# EAGLE design carrier_board (EAGLE 9.4.2)
TITLE: Carrier Board

## Sheet 1 of 5: Slot 1
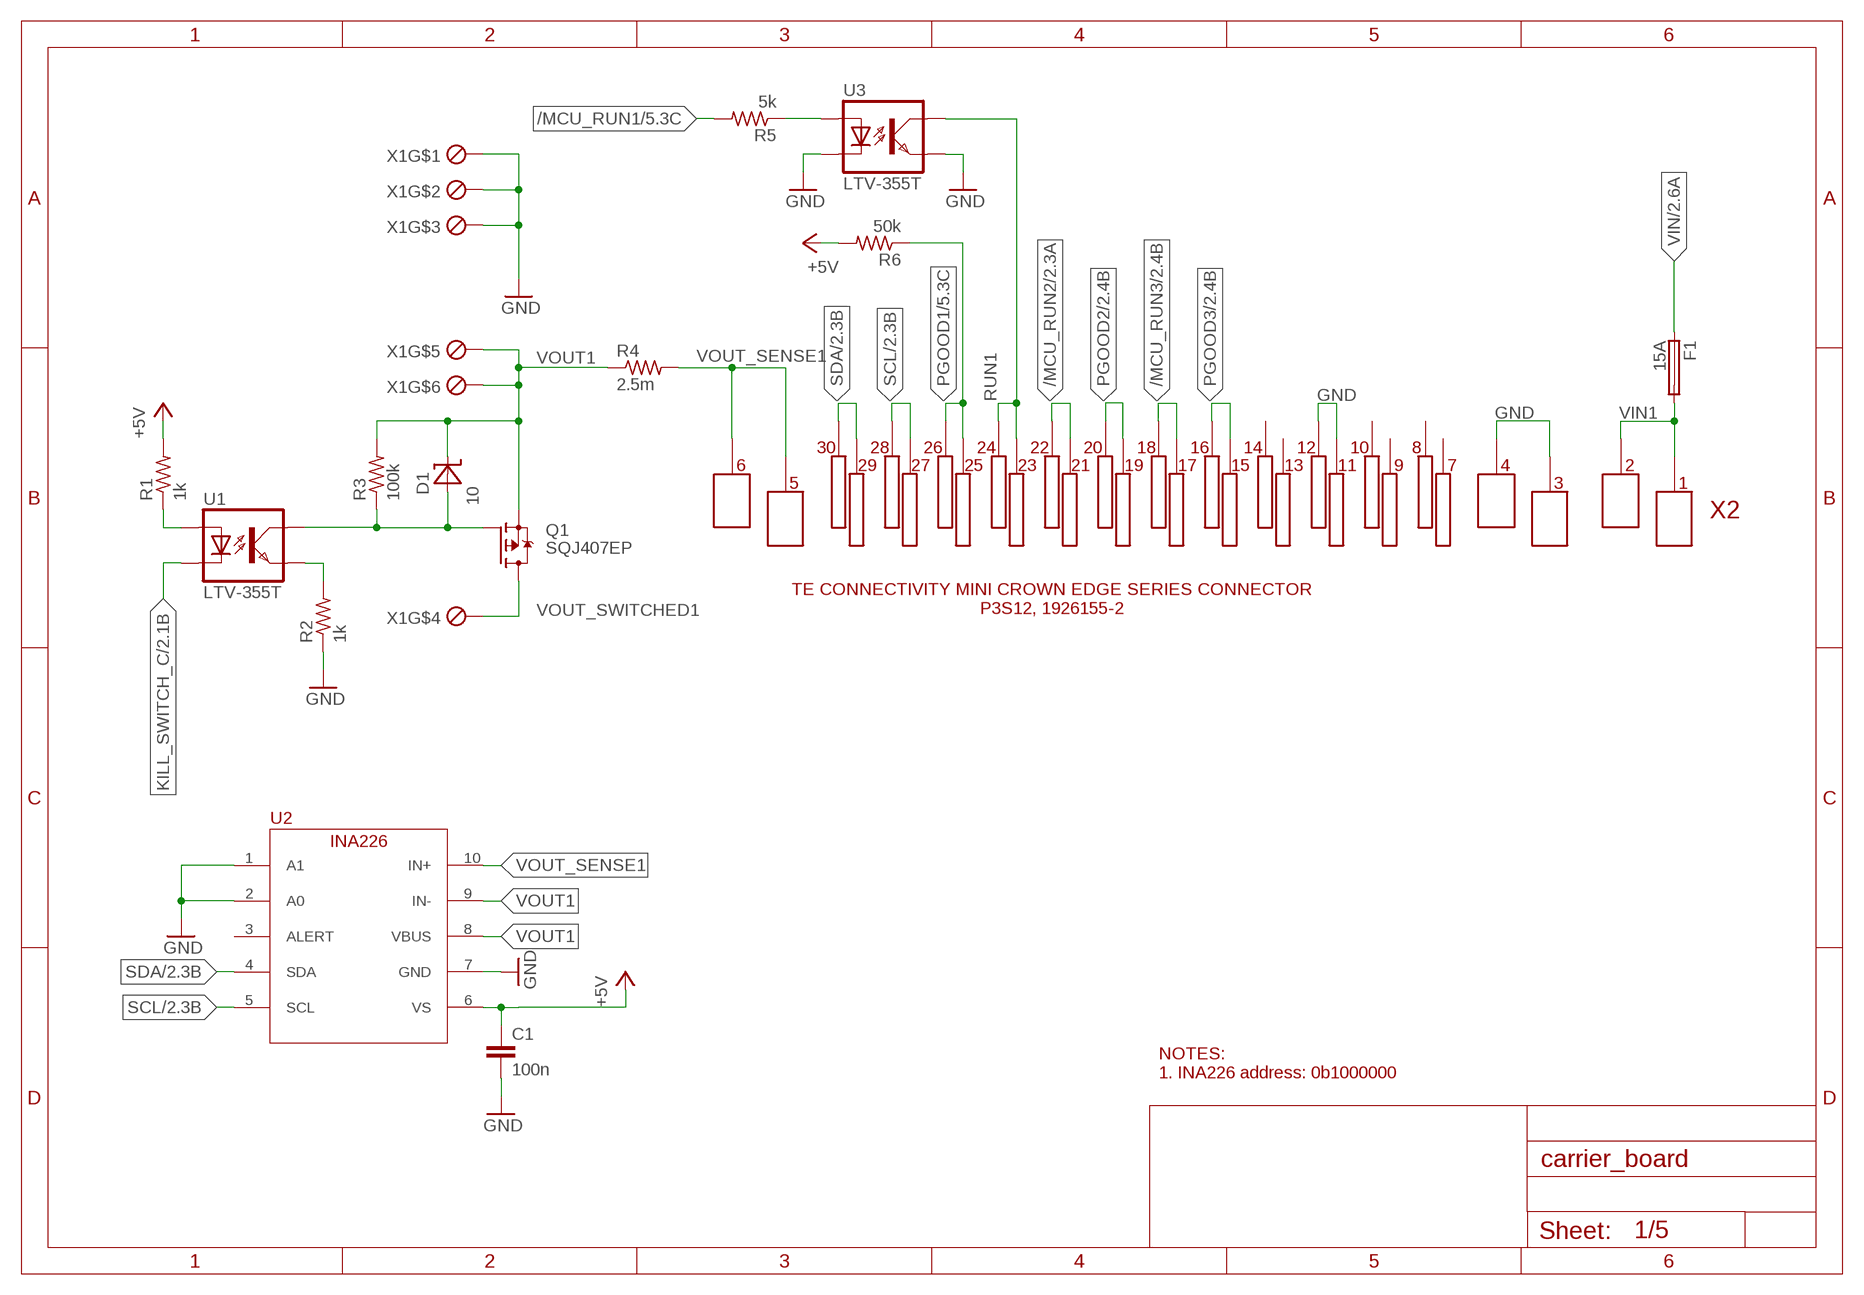
[diagram p0: schematic, sheet 1]

### Parts
C1  100n  C-EUC0603  [C0603]
D1  10  BZT52C10-TP  [SOD123]
F1  15A  3557-10  [3557-10]
Q1  SQJ407EP  [POWERPAK_SO8L_SINGLE]
R1  1k  R-US_R0603  [R0603]
R2  1k  R-US_R0603  [R0603]
R3  100k  R-US_R0603  [R0603]
R4  2.5m  R-US_R2512  [R2512]
R5  5k  R-US_R0603  [R0603]
R6  50k  R-US_R0603  [R0603]
U1  LTV-355T  [SMD4]
U2  INA226  [MSOP10]
U3  LTV-355T  [SMD4]
X1  284391-6  [284391-6]
X2  1926155-2_SOCK  [1926155-2_SOCK]

### Nets
+5V: C1.1 R1.2 R6.2 U2.6(VS) ; also sheet 2,3,4,5
/MCU_RUN1: R5.2 ; also sheet 5
/MCU_RUN2: X2.P$21 X2.P$22 ; also sheet 2,5
/MCU_RUN3: X2.P$17 X2.P$18 ; also sheet 2,3,5
GATE_VOUT1: D1.2(A) Q1.P$4(G) R3.1 U1.COLLECTOR(COL)
GND: C1.2 R2.1 U2.1(A1) U2.2(A0) U2.7(GND) U3.CATHODE(C) U3.EMITTER(EMIT) X1.P$1 X1.P$2 X1.P$3 X2.P$3_1 X2.P$3_2 X2.P$3_3 X2.P$4_1 X2.P$4_2 X2.P$4_3 X2.P$11 X2.P$12 ; also sheet 2,3,4,5
KILL_SWITCH_C: U1.CATHODE(C) ; also sheet 2,3,5
N$2: R2.2 U1.EMITTER(EMIT)
N$3: R5.1 U3.ANODE(A)
N$4: R1.1 U1.ANODE(A)
PGOOD1: R6.1 X2.P$25 X2.P$26 ; also sheet 5
PGOOD2: X2.P$19 X2.P$20 ; also sheet 2,5
PGOOD3: X2.P$15 X2.P$16 ; also sheet 2,3,5
RUN1: U3.COLLECTOR(COL) X2.P$23 X2.P$24
SCL: U2.5(SCL) X2.P$27 X2.P$28 ; also sheet 2,3,5
SDA: U2.4(SDA) X2.P$29 X2.P$30 ; also sheet 2,3,5
VIN: F1.P$1 F1.P$2 ; also sheet 2,3,4,5
VIN1: F1.P$3 F1.P$4 X2.P$1_1 X2.P$1_2 X2.P$1_3 X2.P$2_1 X2.P$2_2 X2.P$2_3
VOUT1: D1.1(C) Q1.P$1(S) Q1.P$2(S) Q1.P$3(S) R3.2 R4.1 U2.8(VBUS) U2.9(IN-) X1.P$5 X1.P$6
VOUT_SENSE1: R4.2 U2.10(IN+) X2.P$5_1 X2.P$5_2 X2.P$5_3 X2.P$6_1 X2.P$6_2 X2.P$6_3
VOUT_SWITCHED1: Q1.P$5(D) Q1.P$6(D) Q1.P$7(D) Q1.P$8(D) X1.P$4
Unconnected: U2.3(ALERT) X2.P$7 X2.P$8 X2.P$9 X2.P$10 X2.P$13 X2.P$14

### Notes on the sheet
- NOTES:
  1. INA226 address: 0b1000000

## Sheet 2 of 5: Slot 2
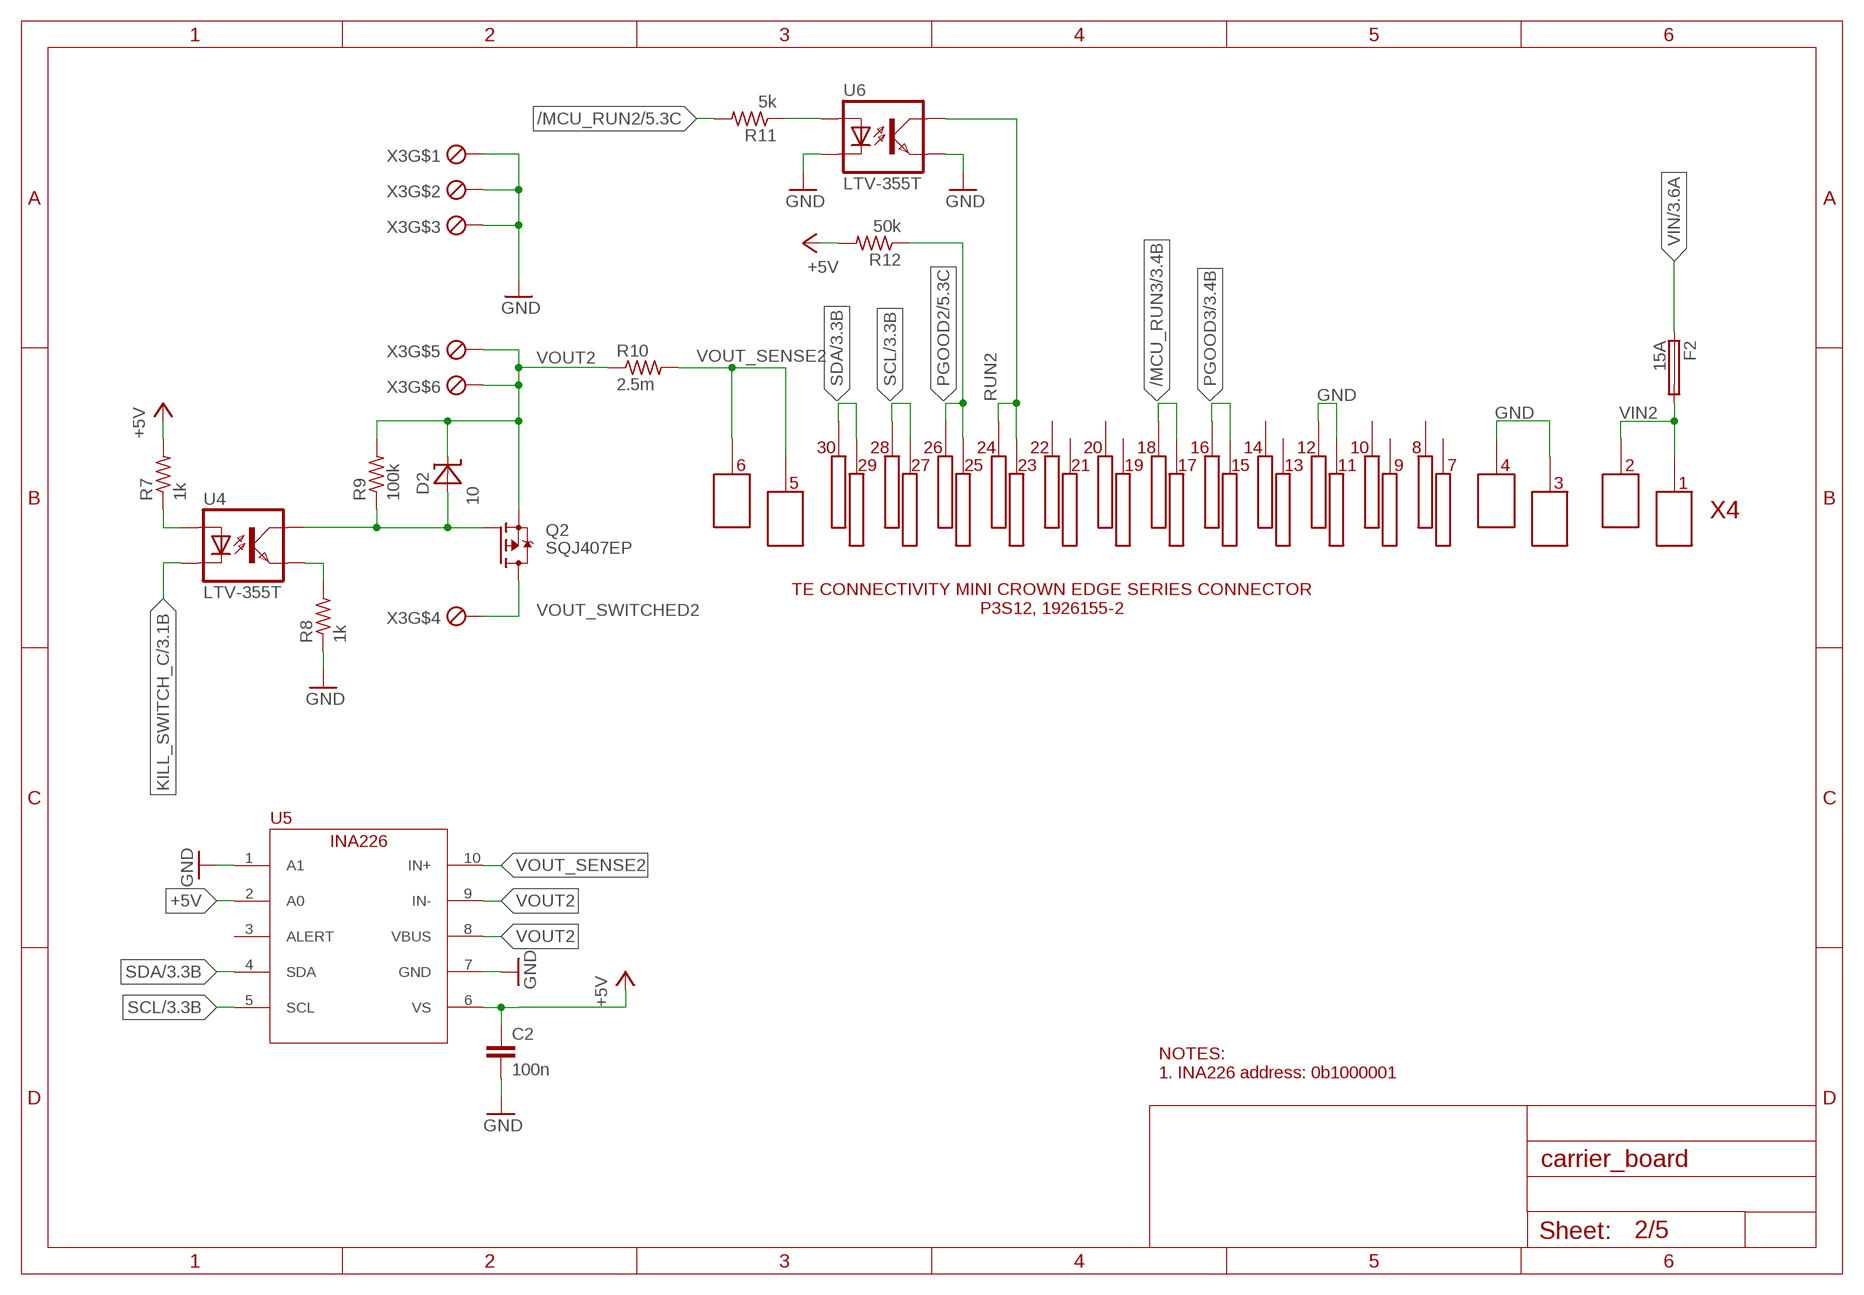
[diagram p1: schematic, sheet 2]

### Parts
C2  100n  C-EUC0603  [C0603]
D2  10  BZT52C10-TP  [SOD123]
F2  15A  3557-10  [3557-10]
Q2  SQJ407EP  [POWERPAK_SO8L_SINGLE]
R7  1k  R-US_R0603  [R0603]
R8  1k  R-US_R0603  [R0603]
R9  100k  R-US_R0603  [R0603]
R10  2.5m  R-US_R2512  [R2512]
R11  5k  R-US_R0603  [R0603]
R12  50k  R-US_R0603  [R0603]
U4  LTV-355T  [SMD4]
U5  INA226  [MSOP10]
U6  LTV-355T  [SMD4]
X3  284391-6  [284391-6]
X4  1926155-2_SOCK  [1926155-2_SOCK]

### Nets
+5V: C2.1 R7.2 R12.2 U5.2(A0) U5.6(VS) ; also sheet 1,3,4,5
/MCU_RUN2: R11.2 ; also sheet 1,5
/MCU_RUN3: X4.P$17 X4.P$18 ; also sheet 1,3,5
GATE_VOUT2: D2.2(A) Q2.P$4(G) R9.1 U4.COLLECTOR(COL)
GND: C2.2 R8.1 U5.1(A1) U5.7(GND) U6.CATHODE(C) U6.EMITTER(EMIT) X3.P$1 X3.P$2 X3.P$3 X4.P$3_1 X4.P$3_2 X4.P$3_3 X4.P$4_1 X4.P$4_2 X4.P$4_3 X4.P$11 X4.P$12 ; also sheet 1,3,4,5
KILL_SWITCH_C: U4.CATHODE(C) ; also sheet 1,3,5
N$7: R8.2 U4.EMITTER(EMIT)
N$8: R7.1 U4.ANODE(A)
N$9: R11.1 U6.ANODE(A)
PGOOD2: R12.1 X4.P$25 X4.P$26 ; also sheet 1,5
PGOOD3: X4.P$15 X4.P$16 ; also sheet 1,3,5
RUN2: U6.COLLECTOR(COL) X4.P$23 X4.P$24
SCL: U5.5(SCL) X4.P$27 X4.P$28 ; also sheet 1,3,5
SDA: U5.4(SDA) X4.P$29 X4.P$30 ; also sheet 1,3,5
VIN: F2.P$1 F2.P$2 ; also sheet 1,3,4,5
VIN2: F2.P$3 F2.P$4 X4.P$1_1 X4.P$1_2 X4.P$1_3 X4.P$2_1 X4.P$2_2 X4.P$2_3
VOUT2: D2.1(C) Q2.P$1(S) Q2.P$2(S) Q2.P$3(S) R9.2 R10.1 U5.8(VBUS) U5.9(IN-) X3.P$5 X3.P$6
VOUT_SENSE2: R10.2 U5.10(IN+) X4.P$5_1 X4.P$5_2 X4.P$5_3 X4.P$6_1 X4.P$6_2 X4.P$6_3
VOUT_SWITCHED2: Q2.P$5(D) Q2.P$6(D) Q2.P$7(D) Q2.P$8(D) X3.P$4
Unconnected: U5.3(ALERT) X4.P$7 X4.P$8 X4.P$9 X4.P$10 X4.P$13 X4.P$14 X4.P$19 X4.P$20 X4.P$21 X4.P$22

### Notes on the sheet
- NOTES:
  1. INA226 address: 0b1000001

## Sheet 3 of 5: Slot 3
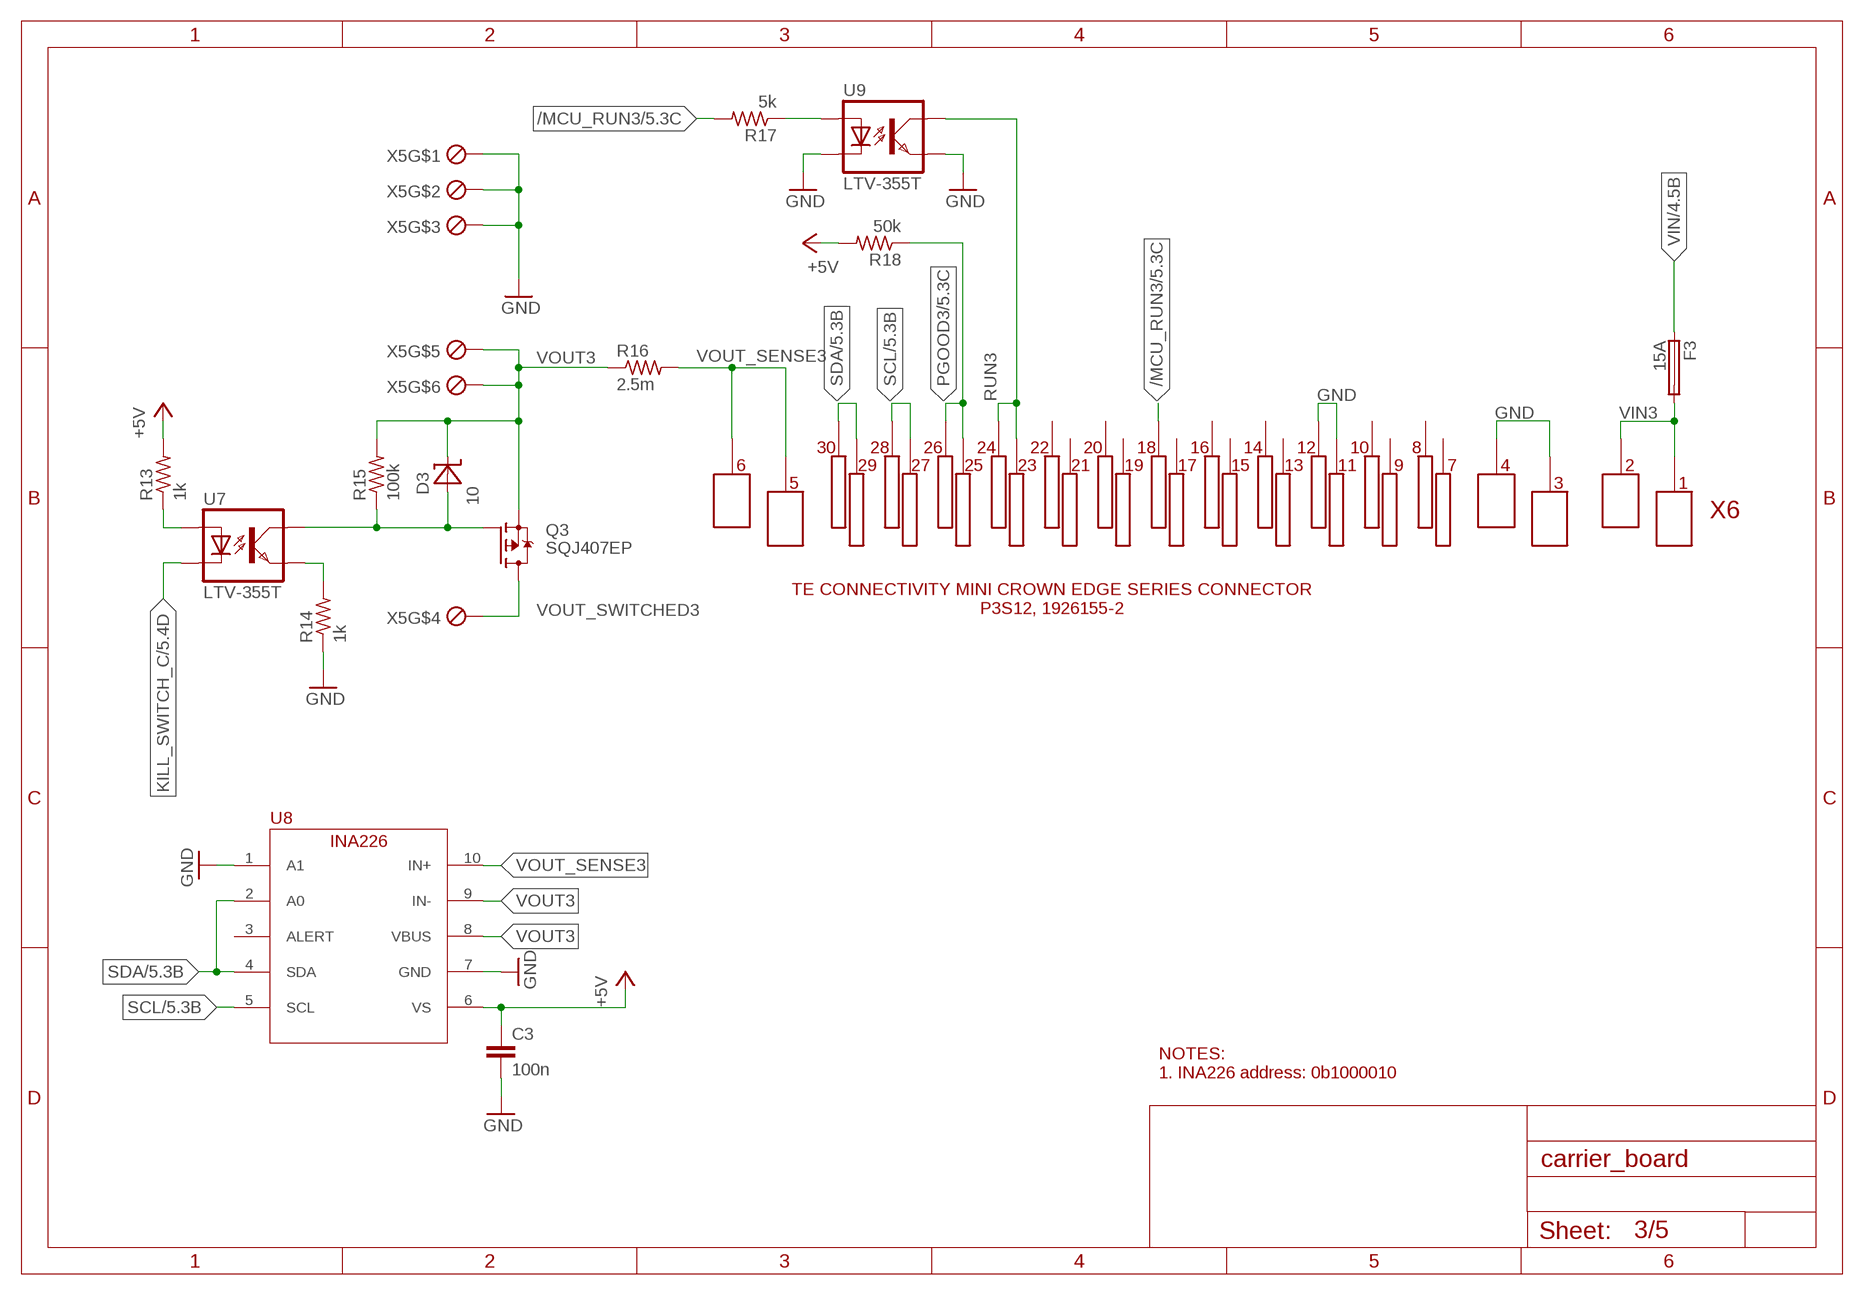
[diagram p2: schematic, sheet 3]

### Parts
C3  100n  C-EUC0603  [C0603]
D3  10  BZT52C10-TP  [SOD123]
F3  15A  3557-10  [3557-10]
Q3  SQJ407EP  [POWERPAK_SO8L_SINGLE]
R13  1k  R-US_R0603  [R0603]
R14  1k  R-US_R0603  [R0603]
R15  100k  R-US_R0603  [R0603]
R16  2.5m  R-US_R2512  [R2512]
R17  5k  R-US_R0603  [R0603]
R18  50k  R-US_R0603  [R0603]
U7  LTV-355T  [SMD4]
U8  INA226  [MSOP10]
U9  LTV-355T  [SMD4]
X5  284391-6  [284391-6]
X6  1926155-2_SOCK  [1926155-2_SOCK]

### Nets
+5V: C3.1 R13.2 R18.2 U8.6(VS) ; also sheet 1,2,4,5
/MCU_RUN3: R17.2 X6.P$18 ; also sheet 1,2,5
GATE_VOUT3: D3.2(A) Q3.P$4(G) R15.1 U7.COLLECTOR(COL)
GND: C3.2 R14.1 U8.1(A1) U8.7(GND) U9.CATHODE(C) U9.EMITTER(EMIT) X5.P$1 X5.P$2 X5.P$3 X6.P$3_1 X6.P$3_2 X6.P$3_3 X6.P$4_1 X6.P$4_2 X6.P$4_3 X6.P$11 X6.P$12 ; also sheet 1,2,4,5
KILL_SWITCH_C: U7.CATHODE(C) ; also sheet 1,2,5
N$13: R14.2 U7.EMITTER(EMIT)
N$14: R13.1 U7.ANODE(A)
N$15: R17.1 U9.ANODE(A)
PGOOD3: R18.1 X6.P$25 X6.P$26 ; also sheet 1,2,5
RUN3: U9.COLLECTOR(COL) X6.P$23 X6.P$24
SCL: U8.5(SCL) X6.P$27 X6.P$28 ; also sheet 1,2,5
SDA: U8.2(A0) U8.4(SDA) X6.P$29 X6.P$30 ; also sheet 1,2,5
VIN: F3.P$1 F3.P$2 ; also sheet 1,2,4,5
VIN3: F3.P$3 F3.P$4 X6.P$1_1 X6.P$1_2 X6.P$1_3 X6.P$2_1 X6.P$2_2 X6.P$2_3
VOUT3: D3.1(C) Q3.P$1(S) Q3.P$2(S) Q3.P$3(S) R15.2 R16.1 U8.8(VBUS) U8.9(IN-) X5.P$5 X5.P$6
VOUT_SENSE3: R16.2 U8.10(IN+) X6.P$5_1 X6.P$5_2 X6.P$5_3 X6.P$6_1 X6.P$6_2 X6.P$6_3
VOUT_SWITCHED3: Q3.P$5(D) Q3.P$6(D) Q3.P$7(D) Q3.P$8(D) X5.P$4
Unconnected: U8.3(ALERT) X6.P$7 X6.P$8 X6.P$9 X6.P$10 X6.P$13 X6.P$14 X6.P$15 X6.P$16 X6.P$17 X6.P$19 X6.P$20 X6.P$21 X6.P$22

### Notes on the sheet
- NOTES:
  1. INA226 address: 0b1000010

## Sheet 4 of 5: Hotswap System
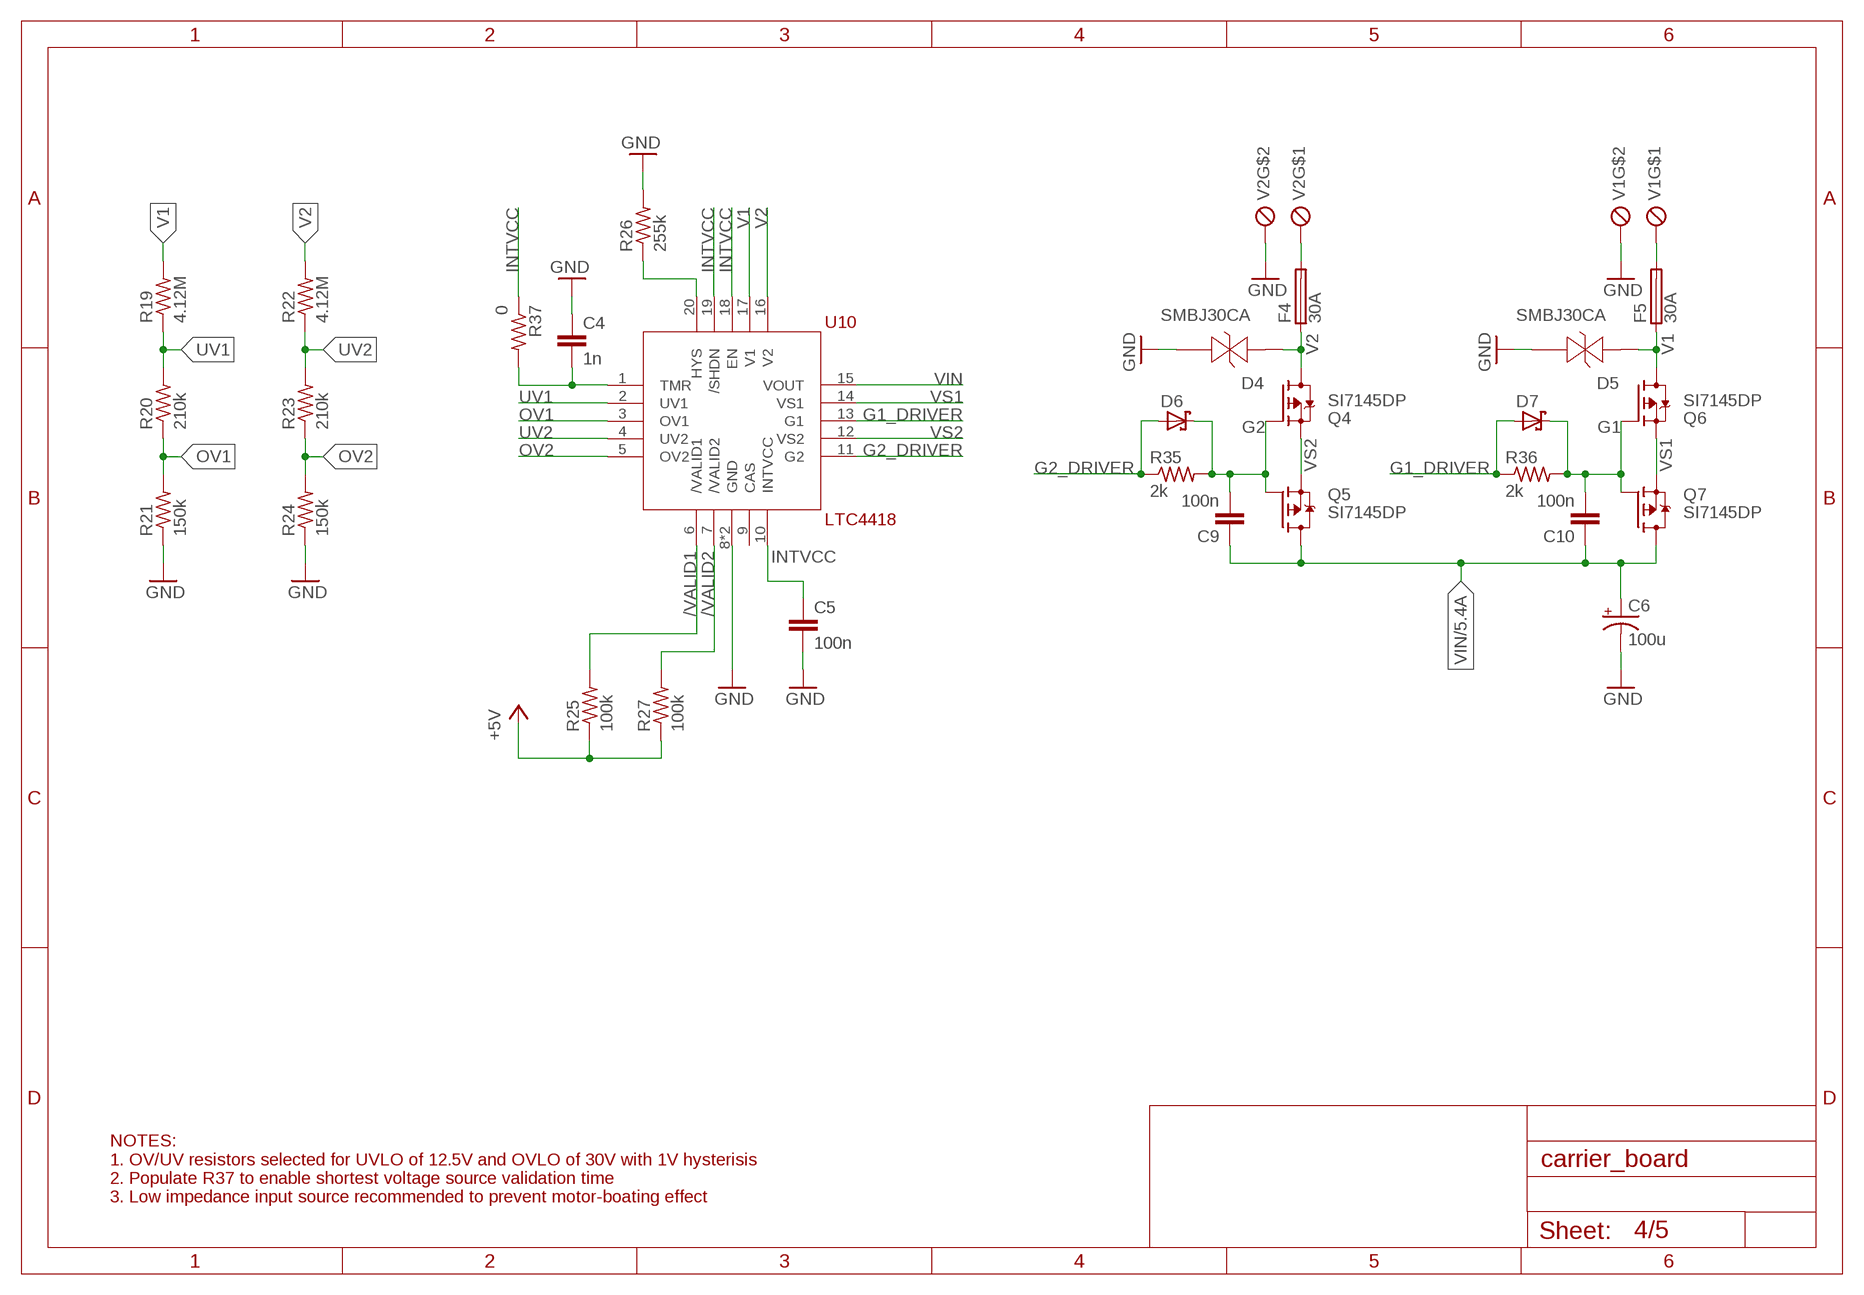
[diagram p3: schematic, sheet 4]

### Parts
C4  1n  C-EUC0402  [C0402]
C5  100n  C-EUC0402  [C0402]
C6  100u  CPOL-USE5-10.5  [E5-10,5]
C9  100n  C-EUC0603  [C0603]
C10  100n  C-EUC0603  [C0603]
D4  SMBJ30CA  [DO214AA]
D5  SMBJ30CA  [DO214AA]
D6  SD0603S040S0R2  [CHIPLED_0603]
D7  SD0603S040S0R2  [CHIPLED_0603]
F4  30A  3557-10  [3557-10]
F5  30A  3557-10  [3557-10]
Q4  SI7145DP  SI7145  [SO-8-POWERPAK]
Q5  SI7145DP  SI7145  [SO-8-POWERPAK]
Q6  SI7145DP  SI7145  [SO-8-POWERPAK]
Q7  SI7145DP  SI7145  [SO-8-POWERPAK]
R19  4.12M  R-US_R0402  [R0402]
R20  210k  R-US_R0402  [R0402]
R21  150k  R-US_R0402  [R0402]
R22  4.12M  R-US_R0402  [R0402]
R23  210k  R-US_R0402  [R0402]
R24  150k  R-US_R0402  [R0402]
R25  100k  R-US_R0603  [R0603]
R26  255k  R-US_R0402  [R0402]
R27  100k  R-US_R0603  [R0603]
R35  2k  R-US_R0603  [R0603]
R36  2k  R-US_R0603  [R0603]
R37  0  R-US_R0402  [R0402]
U10  LTC4418  [QFN20]
V1  MKDSD_1730502  [MKDSD_1730502]
V2  MKDSD_1730502  [MKDSD_1730502]

### Nets
+5V: R25.1 R27.1 ; also sheet 1,2,3,5
/VALID1: R25.2 U10.6(/VALID1) ; also sheet 5
/VALID2: R27.2 U10.7(/VALID2) ; also sheet 5
G1: C10.2 D7.C Q6.4(G) Q7.4(G) R36.2
G1_DRIVER: D7.A R36.1 U10.13(G1)
G2: C9.2 D6.C Q4.4(G) Q5.4(G) R35.2
G2_DRIVER: D6.A R35.1 U10.11(G2)
GND: C4.1 C5.2 C6.- D4.A D5.A R21.1 R24.1 R26.2 U10.8(GND) U10.EXP(GND) V1.P$2 V1.P$4 V2.P$2 V2.P$4 ; also sheet 1,2,3,5
HYS: R26.1 U10.20(HYS)
INTVCC: C5.1 R37.1 U10.10(INTVCC) U10.18(EN) U10.19(/SHDN)
OV1: R20.1 R21.2 U10.3(OV1)
OV2: R23.1 R24.2 U10.5(OV2)
TMR: C4.2 R37.2 U10.1(TMR)
UV1: R19.1 R20.2 U10.2(UV1)
UV2: R22.1 R23.2 U10.4(UV2)
V1: D5.C F5.P$1 F5.P$2 Q6.5(D) Q6.6(D) Q6.7(D) Q6.8(D) Q6.P$1(D) R19.2 U10.17(V1)
V2: D4.C F4.P$1 F4.P$2 Q4.5(D) Q4.6(D) Q4.7(D) Q4.8(D) Q4.P$1(D) R22.2 U10.16(V2)
VBAT1: F5.P$3 F5.P$4 V1.P$1 V1.P$3
VBAT2: F4.P$3 F4.P$4 V2.P$1 V2.P$3
VIN: C6.+ C9.1 C10.1 Q5.5(D) Q5.6(D) Q5.7(D) Q5.8(D) Q5.P$1(D) Q7.5(D) Q7.6(D) Q7.7(D) Q7.8(D) Q7.P$1(D) U10.15(VOUT) ; also sheet 1,2,3,5
VS1: Q6.1(S) Q6.2(S) Q6.3(S) Q7.1(S) Q7.2(S) Q7.3(S) U10.14(VS1)
VS2: Q4.1(S) Q4.2(S) Q4.3(S) Q5.1(S) Q5.2(S) Q5.3(S) U10.12(VS2)
Unconnected: U10.9(CAS)

### Notes on the sheet
- NOTES:
  1. OV/UV resistors selected for UVLO of 12.5V and OVLO of 30V with 1V hysterisis
  2. Populate R37 to enable shortest voltage source validation time
  3. Low impedance input source recommended to prevent motor-boating effect

## Sheet 5 of 5: Support Systems
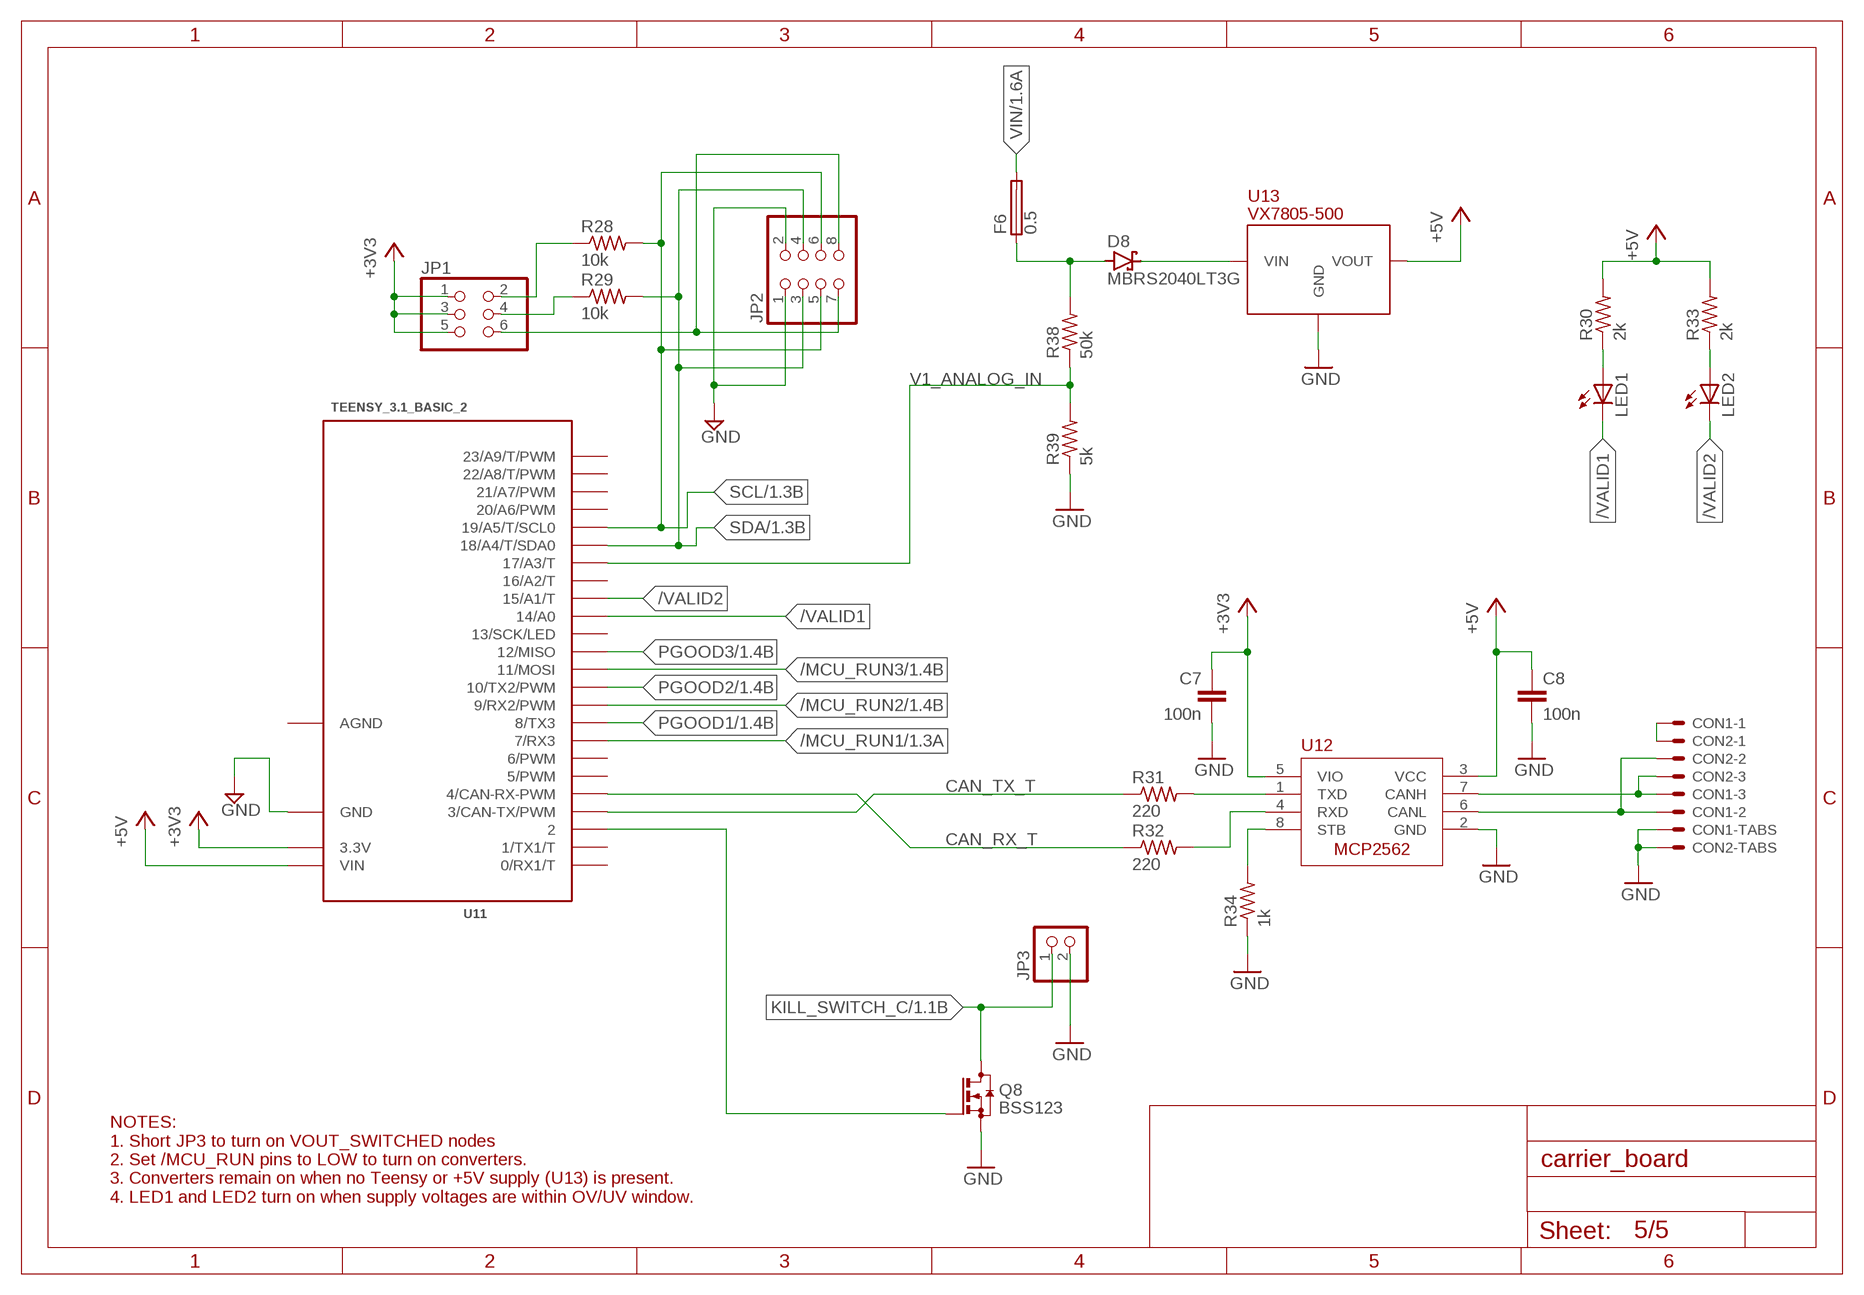
[diagram p4: schematic, sheet 5]

### Parts
C7  100n  C-EUC0805  [C0805]
C8  100n  C-EUC0805  [C0805]
CON1  SM03B-GHS-TB  [SM03B-GHS-TB]
CON2  SM03B-GHS-TB  [SM03B-GHS-TB]
D8  MBRS2040LT3G  MBRS130LT3  [SMB]
F6  0.5  501_FUSE  [R1206]
JP1  PINHD-2X3  [2X03]
JP2  PINHD-2X4  [2X04]
JP3  PINHD-1X02_2.54-SMD-90°  [1X02SMD/90]
LED1  LEDCHIPLED_0603  [CHIPLED_0603]
LED2  LEDCHIPLED_0603  [CHIPLED_0603]
Q8  BSS123  [SOT23]
R28  10k  R-US_R0805  [R0805]
R29  10k  R-US_R0805  [R0805]
R30  2k  R-US_R0603  [R0603]
R31  220  R-US_R0805  [R0805]
R32  220  R-US_R0805  [R0805]
R33  2k  R-US_R0603  [R0603]
R34  1k  R-US_R0805  [R0805]
R38  50k  R-US_R0603  [R0603]
R39  5k  R-US_R0603  [R0603]
U11  TEENSY_3.1_BASIC_2  [TEENSY_3.1_BASIC_2]
U12  MCP2562  [SO-8]
U13  VX7805-500  0.1"_LINEAR_REGULATOR_REPLACEMENT  [0.1"_LINEAR_REGULATOR_REPLACEMENT]

### Nets
+3V3: C7.1 JP1.1 JP1.3 JP1.5 U11.3.3V U12.5(VIO)
+5V: C8.1 R30.2 R33.2 U11.VIN U12.3(VCC) U13.3(VOUT) ; also sheet 1,2,3,4
/MCU_RUN1: U11.7(7/RX3) ; also sheet 1
/MCU_RUN2: U11.9(9/RX2/PWM) ; also sheet 1,2
/MCU_RUN3: U11.11(11/MOSI) ; also sheet 1,2,3
/VALID1: LED1.C U11.14/A0 ; also sheet 4
/VALID2: LED2.C U11.15/A1(15/A1/T) ; also sheet 4
CAN_RX: R32.2 U12.4(RXD)
CAN_RX_T: R32.1 U11.4(4/CAN-RX-PWM)
CAN_TX: R31.2 U12.1(TXD)
CAN_TX_T: R31.1 U11.3(3/CAN-TX/PWM)
CANH: CON1.P$3 CON2.P$3 U12.7(CANH)
CANL: CON1.P$2 CON2.P$2 U12.6(CANL)
CANSH: CON1.P$1 CON2.P$1
GND: C7.2 C8.2 CON1.P$4 CON1.P$5 CON2.P$4 CON2.P$5 JP2.1 JP2.2 JP3.2 Q8.2(S) R34.1 R39.1 U11.GND U12.2(GND) U13.2(GND) ; also sheet 1,2,3,4
I2C_3V3: JP1.6 JP2.7 JP2.8
KILL_SWITCH_C: JP3.1 Q8.3(D) ; also sheet 1,2,3
N$1: D8.A F6.1 R38.2
N$5: LED1.A R30.1
N$6: LED2.A R33.1
N$10: Q8.1(G) U11.2
N$11: D8.C U13.1(VIN)
PGOOD1: U11.8(8/TX3) ; also sheet 1
PGOOD2: U11.10(10/TX2/PWM) ; also sheet 1,2
PGOOD3: U11.12(12/MISO) ; also sheet 1,2,3
SCL: JP2.5 JP2.6 R28.2 U11.19/A5(19/A5/T/SCL0) ; also sheet 1,2,3
SCL_3V3: JP1.2 R28.1
SDA: JP2.3 JP2.4 R29.2 U11.18/A4(18/A4/T/SDA0) ; also sheet 1,2,3
SDA_3V3: JP1.4 R29.1
STB: R34.2 U12.8(STB)
V1_ANALOG_IN: R38.1 R39.2 U11.17/A3(17/A3/T)
VIN: F6.2 ; also sheet 1,2,3,4
Unconnected: U11.0(0/RX1/T) U11.1(1/TX1/T) U11.5(5/PWM) U11.6(6/PWM) U11.13(13/SCK/LED) U11.16/A2(16/A2/T) U11.20/A6(20/A6/PWM) U11.21/A7(21/A7/PWM) U11.22/A8(22/A8/T/PWM) U11.23/A9(23/A9/T/PWM)

### Notes on the sheet
- NOTES:
  1. Short JP3 to turn on VOUT_SWITCHED nodes
  2. Set /MCU_RUN pins to LOW to turn on converters.
  3. Converters remain on when no Teensy or +5V supply (U13) is present.
  4. LED1 and LED2 turn on when supply voltages are within OV/UV window.

## Power pins joined to a net without a drawn wire
AGND: U11.AGND

## Library data of the parts
C1-C5 C7-C10 = rcl:C-EU: CAPACITOR, European symbol; SPICEPREFIX: C
C6 = rcl:CPOL-US: POLARIZED CAPACITOR, American symbol; SPICEPREFIX: C
CON1 CON2 = ARVP:SM03B-GHS-TB
D1-D3 = LTM4607:BZT52C10-TP
D4 D5 = LTM4607:SMBJ30CA
D6 D7 = LTM4607:SD0603S040S0R2
D8 = diode:MBRS130LT3: Schottky Power Rectifier Source: http://www.onsemi.com/pub/Collateral/MBRS130LT3-D.PDF
F1-F5 = LTM4607:3557-10
F6 = LTM4607:501_FUSE
JP1 = pinhead:PINHD-2X3: PIN HEADER
JP2 = pinhead:PINHD-2X4: PIN HEADER
JP3 = pinhead-2:PINHD-1X02: PIN HEADER
LED1 LED2 = led:LED: LED OSRAM: - CHIPLED LG R971, LG N971, LY N971, LG Q971, LY Q971, LO R971, LY R971 LH N974, LH R974 LS Q976, LO Q976, LY Q976 LO Q996 - Hyper CHIPLED LW Q18S LB Q993, LB Q99A, LB R99A - SideLED LS A670, LO A670, LY A670, LG A670, LP A670 LB A673, LV A673, LT A673, LW A673 LH A674 LY A675 LS A676, LA A676, LO A676, LY A676, LW A676 LS A679, LY A679, LG A679 - Hyper Micro SIDELED® LS Y876, LA Y876, LO Y876, LY Y876 LT Y87S - SmartLED LW L88C, LW L88S LB L89C, LB L89S, LG L890 LS L89K, LO L89K, LY L89K LS L896, LA L896, LO L896, LY L896 - TOPLED LS T670, LO T670, LY T670, LG T670, LP T670 LSG T670, LSP T670, LSY T670, LOP T670, LYG T670 LG T671, LOG T671, LSG T671 LB T673, LV T673, LT T673, LW T673 LH T674 LS T676, LA T676, LO T676, LY T676, LB T676, LH T676, LSB T676, LW T676 LB T67C, LV T67C, LT T67C, LS T67K, LO T67K, LY T67K, LW E67C LS E67B, LA E67B, LO E67B, LY E67B, LB E67C, LV E67C, LT E67C LW T67C LS T679, LY T679, LG T679 LS T770, LO T770, LY T770, LG T770, LP T770 LB T773, LV T773, LT T773, LW T773 LH T774 LS E675, LA E675, LY E675, LS T675 LS T776, LA T776, LO T776, LY T776, LB T776 LHGB T686 LT T68C, LB T68C - Hyper Mini TOPLED® LB M676 - Mini TOPLED Santana® LG M470 LS M47K, LO M47K, LY M47K Source: http://www.osram.convergy.de LUXEON: - LUMILED® LXK2-PW12-R00, LXK2-PW12-S00, LXK2-PW14-U00, LXK2-PW14-V00 LXK2-PM12-R00, LXK2-PM12-S00, LXK2-PM14-U00 LXK2-PE12-Q00, LXK2-PE12-R00, LXK2-PE12-S00, LXK2-PE14-T00, LXK2-PE14-U00 LXK2-PB12-K00, LXK2-PB12-L00, LXK2-PB12-M00, LXK2-PB14-N00, LXK2-PB14-P00, LXK2-PB14-Q00 LXK2-PR12-L00, LXK2-PR12-M00, LXK2-PR14-Q00, LXK2-PR14-R00 LXK2-PD12-Q00, LXK2-PD12-R00, LXK2-PD12-S00 LXK2-PH12-R00, LXK2-PH12-S00 LXK2-PL12-P00, LXK2-PL12-Q00, LXK2-PL12-R00 Source: www.luxeon.com KINGBRIGHT: KA-3528ASYC Source: www.kingbright.com
Q1-Q3 = LTM4607:SQJ407EP
Q4-Q7 = LTM4607:SI7145
Q8 = transistor-small-signal:BSS123: N-CHANNEL MOS FET
R1-R39 = rcl:R-US_: RESISTOR, American symbol; SPICEPREFIX: R
U1 U3 U4 U6 U7 U9 = dropper_torpedo_v3:LTV-355T
U2 U5 U8 = LTM4607:INA226
U10 = LTM4607:LTC4418
U11 = Teensy_3_Series_Board_v1.0:TEENSY_3.1_BASIC_2: Footprint for Teensy 3.1 board using all pin connections on the outer perimeter
U12 = ARVP:MCP2562
U13 = LTM4607:0.1"_LINEAR_REGULATOR_REPLACEMENT
V1 V2 = LTM4607:MKDSD_1730502
X1 X3 X5 = LTM4607:284391-6
X2 X4 X6 = LTM4607:1926155-2_SOCK

## Net classes
1 net1: clearance 0.203 mm to class 0

## Board
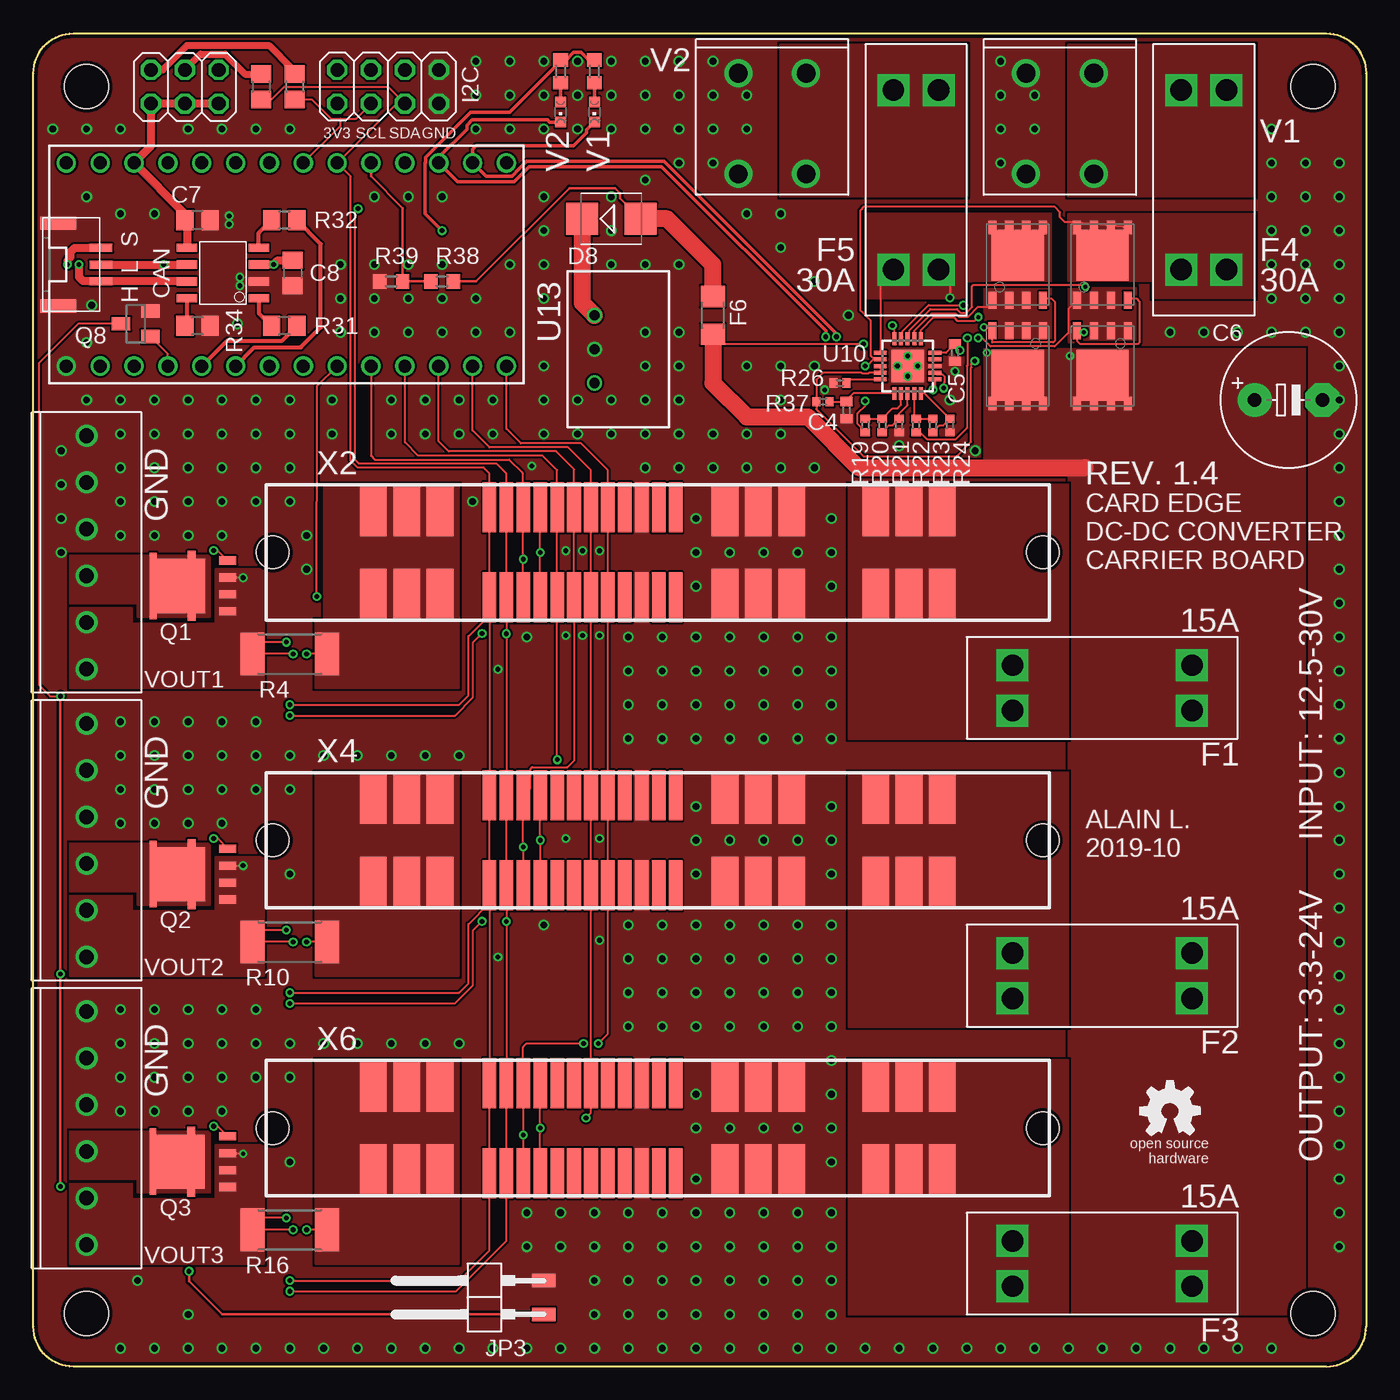
[diagram p5: board, top side]
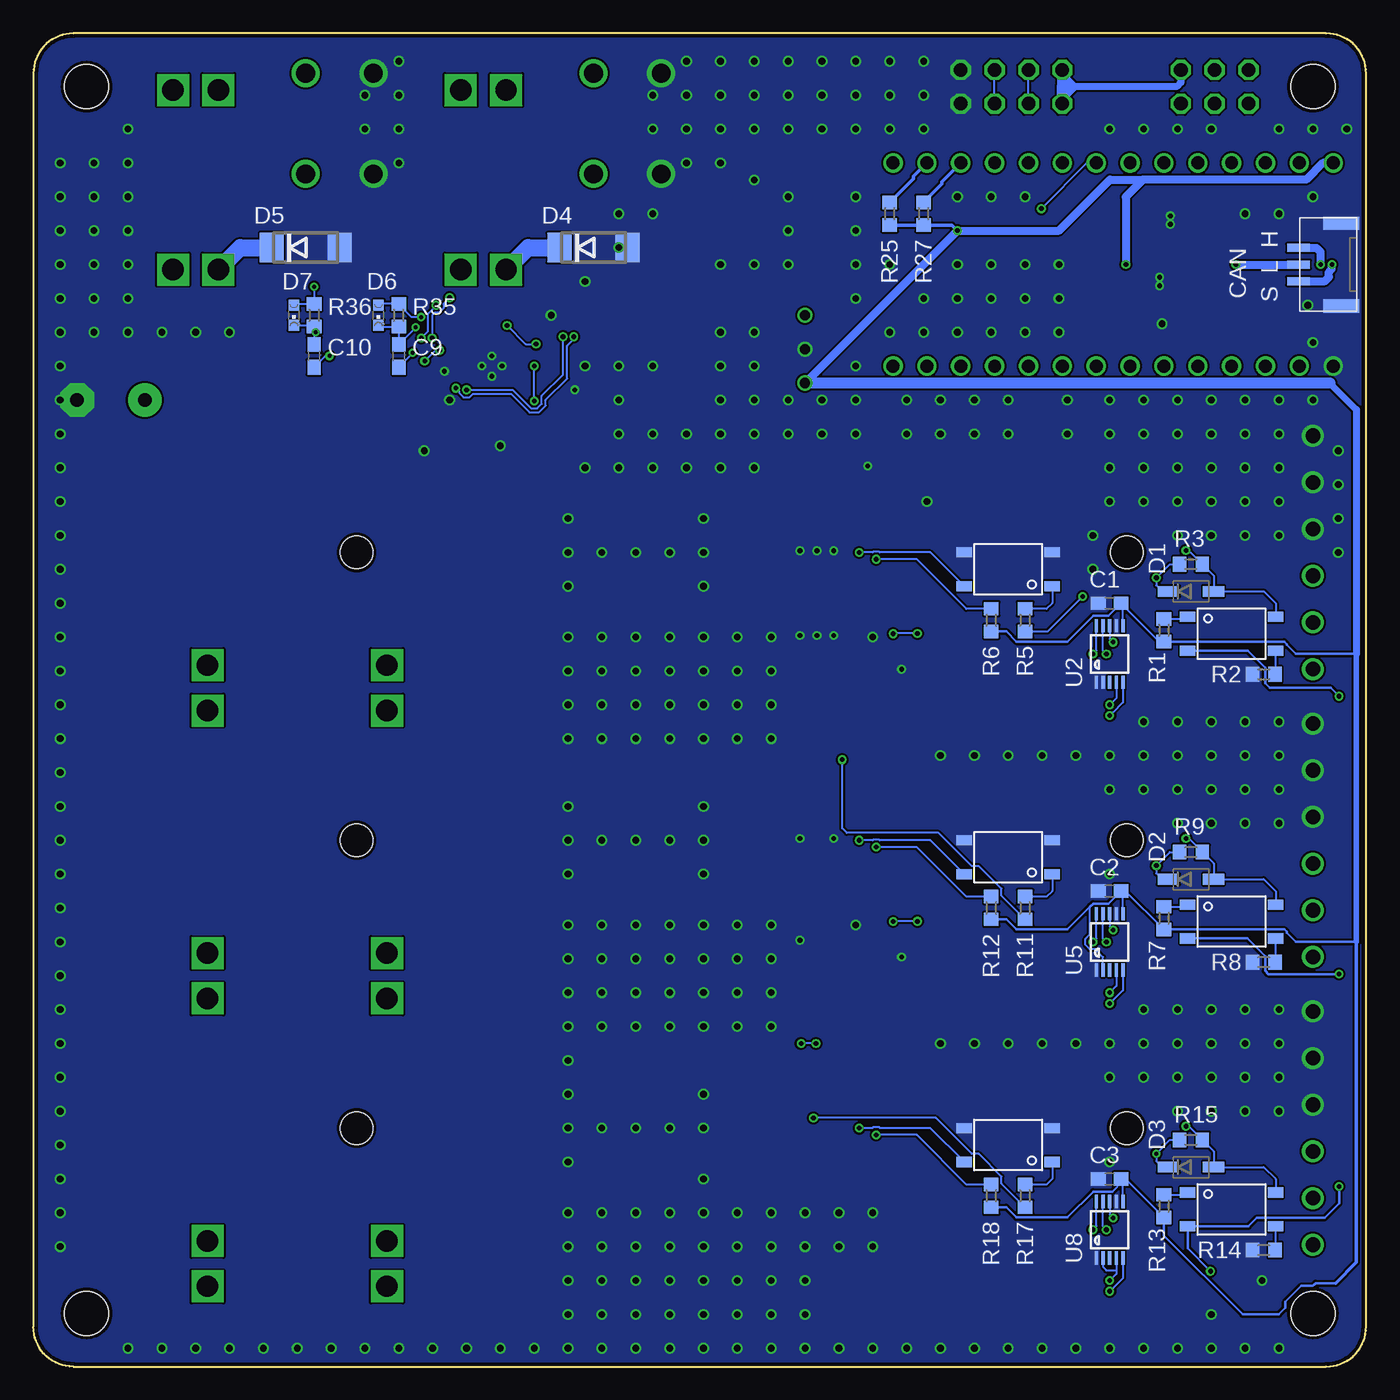
[diagram p6: board, bottom side, seen from below]

Size 100 x 100 mm. Coordinates in mm from the lower left corner, seen from the top.
Outline: 0,3 0,97 arc-90 3,100 97,100 arc-90 100,97 100,3 arc-90 97,0 3,0 arc-90 0,3
Copper layers (1*16): Top 0.035mm / dielectric 1.5mm / Bottom 0.035mm
Design rules "JLCPCB2Layer *": minimum track width 6mil, minimum drill 10mil, track to track 6mil, track to pad 6mil, pad to pad 6mil, via to via 6mil, smd to smd 0mil, copper to edge 10mil, drill to drill 10mil, minimum pad ring 6mil, minimum via ring 6mil, stop-mask expansion 2mil, vias tented up to drill 100mil, thermal gap 10mil

### Footprints (pad centres in the part's own frame; a part is rotated, then mirrored left to right if it is on the bottom)
C0603 = smd 1.1 x 1: 1 -0.85,0; 2 0.85,0
C0402 = smd 0.7 x 0.9: 1 -0.65,0; 2 0.65,0
E5-10,5 = drill 1.016 pad 2.54: + -2.54,0 | drill 1.016 pad 2.54 octagon: - 2.54,0
C0805 = smd 1.3 x 1.5: 1 -0.95,0; 2 0.95,0
SM03B-GHS-TB = smd 0.6 x 1.7: P$1 -1.25,0.85; P$2 0,0.85; P$3 1.25,0.85 | smd 1 x 2.7: P$4 -3.1,-2.35; P$5 3.1,-2.35
SOD123 = smd 1.6 x 0.8: 1 -1.7,0; 2 1.7,0
DO214AA = smd 1.8 x 2.2: A 2.55,0; C -2.55,0
CHIPLED_0603 = smd 0.8 x 0.8: A 0,-0.75; C 0,0.75
SMB = smd 2.4 x 2.4: A 2.2,0; C -2.2,0
3557-10 = drill 1.6 square: P$1 -6.731,-1.702; P$2 -6.731,1.702; P$3 6.731,-1.702; P$4 6.731,1.702
R1206 = smd 1.6 x 1.803: 1 -1.422,0; 2 1.422,0
2X03 = drill 1.016 octagon: 1 -2.54,-1.27; 2 -2.54,1.27; 3 0,-1.27; 4 0,1.27; 5 2.54,-1.27; 6 2.54,1.27
2X04 = drill 1.016 octagon: 1 -3.81,-1.27; 2 -3.81,1.27; 3 -1.27,-1.27; 4 -1.27,1.27; 5 1.27,-1.27; 6 1.27,1.27; 7 3.81,-1.27; 8 3.81,1.27
1X02SMD/90 = smd 1.016 x 1.778: 1 -1.27,-5.08; 2 1.27,-5.08
POWERPAK_SO8L_SINGLE = smd 0.61 x 1.27: P$1 -1.905,0; P$2 -0.635,0; P$3 0.635,0; P$4 1.905,0 | smd 4.061 x 3.63: P$5 0,3.527 | smd 0.595 x 0.61: P$6 -2.328,2.715; P$7 2.328,2.715 | smd 5 x 0.51: P$8 0,5.596
SO-8-POWERPAK = smd 0.61 x 1.27: 1 -1.905,0; 2 -0.635,0; 3 0.635,0; 4 1.905,0 | smd 0.61 x 1.016: 5 1.905,5.461; 6 0.635,5.461; 7 -0.635,5.461; 8 -1.905,5.461 | smd 3.912 x 3.81: P$1 0,3.353
SOT23 = smd 1 x 1.4: 1 -0.95,-1.1; 2 0.95,-1.1; 3 0,1.1
R0603 = smd 1 x 1.1: 1 -0.85,0; 2 0.85,0
R2512 = smd 1.8 x 3.2: 1 -2.8,0; 2 2.8,0
R0402 = smd 0.6 x 0.7: 1 -0.5,0; 2 0.5,0
R0805 = smd 1.3 x 1.5: 1 -0.95,0; 2 0.95,0
SMD4 = smd 0.762 x 1.143: ANODE -1.27,-3.302; CATHODE 1.27,-3.302; COLLECTOR -1.27,3.302; EMITTER 1.27,3.302
MSOP10 = smd 0.25 x 1: 1 -1,-2.113; 2 -0.5,-2.113; 3 0,-2.113; 4 0.5,-2.113; 5 1,-2.113; 6 1,2.113; 7 0.5,2.113; 8 0,2.113; 9 -0.5,2.113; 10 -1,2.113
QFN20 = smd 0.95 x 0.3: 1 -2.05,1; 2 -2.05,0.5; 3 -2.05,0; 4 -2.05,-0.5; 5 -2.05,-1; 11 2.05,-1; 12 2.05,-0.5; 13 2.05,0; 14 2.05,0.5; 15 2.05,1 | smd 0.3 x 0.95: 6 -1,-2.05; 7 -0.5,-2.05; 8 0,-2.05; 9 0.5,-2.05; 10 1,-2.05; 16 1,2.05; 17 0.5,2.05; 18 0,2.05; 19 -0.5,2.05; 20 -1,2.05 | smd 2.45 x 2.45: EXP 0,0
TEENSY_3.1_BASIC_2 = drill 0.965: 0 -7.62,13.97; 1 -7.62,11.43; 2 -7.62,8.89; 3 -7.62,6.35; 3.3V 7.62,11.43; 4 -7.62,3.81; 5 -7.62,1.27; 6 -7.62,-1.27; 7 -7.62,-3.81; 8 -7.62,-6.35; 9 -7.62,-8.89; 10 -7.62,-11.43; 11 -7.62,-13.97; 12 -7.62,-16.51; 13 7.62,-16.51; 14/A0 7.62,-13.97; 15/A1 7.62,-11.43; 16/A2 7.62,-8.89; 17/A3 7.62,-6.35; 18/A4 7.62,-3.81; 19/A5 7.62,-1.27; 20/A6 7.62,1.27; 21/A7 7.62,3.81; 22/A8 7.62,6.35; 23/A9 7.62,8.89; AGND 7.62,13.97; GND -7.62,16.51; VIN 7.62,16.51
SO-8 = smd 1.524 x 0.61: 1 -2.692,1.905; 2 -2.692,0.635; 3 -2.692,-0.635; 4 -2.692,-1.905; 5 2.692,-1.905; 6 2.692,-0.635; 7 2.692,0.635; 8 2.692,1.905
0.1"_LINEAR_REGULATOR_REPLACEMENT = drill 0.762: 1 -2.54,0; 2 0,0; 3 2.54,0
STAND-OFF = hole 3.302: 0,0
MKDSD_1730502 = drill 1.4: P$1 -2.54,-3.81; P$2 2.54,-3.81; P$3 -2.54,3.74; P$4 2.54,3.74
284391-6 = drill 1.1: P$1 -8.75,0; P$2 -5.25,0; P$3 -1.75,0; P$4 1.75,0; P$5 5.25,0; P$6 8.75,0
1926155-2_SOCK = smd 2 x 3.75: P$1_1 50.22,-3.1; P$1_2 47.72,-3.1; P$1_3 45.22,-3.1; P$2_1 50.22,3.1; P$2_2 47.72,3.1; P$2_3 45.22,3.1; P$3_1 38.92,-3.1; P$3_2 36.42,-3.1; P$3_3 33.92,-3.1; P$4_1 38.92,3.1; P$4_2 36.42,3.1; P$4_3 33.92,3.1; P$5_1 12.55,-3.1; P$5_2 10.05,-3.1; P$5_3 7.55,-3.1; P$6_1 12.55,3.1; P$6_2 10.05,3.1; P$6_3 7.55,3.1 | smd 1.02 x 3.75: P$7 30.22,-3.375; P$8 30.22,3.375; P$9 28.95,-3.375; P$10 28.95,3.375; P$11 27.68,-3.375; P$12 27.68,3.375; P$13 26.41,-3.375; P$14 26.41,3.375; P$15 25.14,-3.375; P$16 25.14,3.375; P$17 23.87,-3.375; P$18 23.87,3.375; P$19 22.6,-3.375; P$20 22.6,3.375; P$21 21.33,-3.375; P$22 21.33,3.375; P$23 20.06,-3.375; P$24 20.06,3.375; P$25 18.79,-3.375; P$26 18.79,3.375; P$27 17.52,-3.375; P$28 17.52,3.375; P$29 16.25,-3.375; P$30 16.25,3.375 | hole 2.44: 57.77,0; 0,0

### Placement (x,y rotation side)
C1  19.24,57.26 180 bottom
C2  19.24,35.67 180 bottom
C3  19.24,14.08 180 bottom
C4  61.02,71.74 90 top
C5  69.15,76.06 270 top
C6  94.17,72.5 0 top
C7  12.32,85.99 0 top
C8  19.46,82.02 270 top
C9  72.58,75.8 90 bottom
C10  78.93,75.8 90 bottom
CON1  4.22,82.66 270 top
CON2  4.22,82.66 90 bottom
D1  13.14,58.15 0 bottom
D2  13.14,36.56 0 bottom
D3  13.14,14.97 0 bottom
D4  57.97,83.93 0 bottom
D5  79.57,83.93 0 bottom
D6  74.1,78.85 180 bottom
D7  80.45,78.85 180 bottom
D8  43.37,86.09 0 top
F1  80.2,50.91 180 top
F2  80.2,29.32 180 top
F3  80.2,7.73 180 top
F4  66.23,89.01 90 top
F5  87.82,89.01 90 top
F6  50.99,78.85 270 top
JP1  11.37,95.99 0 top
JP2  26.61,95.99 180 top
JP3  33.21,5.19 90 top
LED1  42.1,94.09 180 top
LED2  39.56,94.09 180 top
Q1  14.59,58.56 90 top
Q2  14.59,36.94 90 top
Q3  14.57,15.38 90 top
Q4  73.85,79.99 0 top
Q5  73.85,77.71 180 top
Q6  80.2,79.99 0 top
Q7  80.2,77.71 180 top
Q8  7.68,78.22 90 top
R1  15.18,55.23 270 bottom
R2  7.68,51.93 0 bottom
R3  13.14,60.18 180 bottom
R4  19.24,53.45 0 top
R5  25.59,55.99 270 bottom
R6  28.13,55.99 270 bottom
R7  15.18,33.64 270 bottom
R8  7.68,30.34 0 bottom
R9  13.14,38.59 180 bottom
R10  19.24,31.86 0 top
R11  25.59,34.4 270 bottom
R12  28.13,34.4 270 bottom
R13  15.18,12.05 270 bottom
R14  7.68,8.75 0 bottom
R15  13.14,17 180 bottom
R16  19.24,10.27 0 top
R17  25.59,12.81 270 bottom
R18  28.13,12.81 270 bottom
R19  62.42,70.59 270 top
R20  63.69,70.59 90 top
R21  64.96,70.59 90 top
R22  66.23,70.59 270 top
R23  67.5,70.59 90 top
R24  68.77,70.59 90 top
R25  35.75,86.47 90 bottom
R26  60.52,73.77 180 top
R27  33.21,86.47 90 bottom
R28  19.62,95.99 270 top
R29  17.08,95.99 270 top
R30  42.1,97.14 90 top
R31  18.83,78.06 180 top
R32  18.83,85.99 180 top
R33  39.56,97.14 90 top
R34  12.32,78.06 180 top
R35  72.58,78.85 270 bottom
R36  78.93,78.85 270 bottom
R37  59.25,72.37 0 top
R38  30.67,81.39 0 top
R39  26.86,81.39 0 top
U1  10.1,54.97 270 bottom
U2  19.24,53.45 0 bottom
U3  26.86,59.8 90 bottom
U4  10.1,33.38 270 bottom
U5  19.24,31.86 0 bottom
U6  26.86,38.21 90 bottom
U7  10.1,11.79 270 bottom
U8  19.24,10.27 0 bottom
U9  26.86,16.62 90 bottom
U10  65.59,75.04 90 top
U11  18.99,82.66 90 top
U12  14.22,82.02 180 top
U13  42.1,76.31 270 top
U$1  [STAND-OFF]  4,4 0 top
U$2  [STAND-OFF]  96,4 0 top
U$3  [STAND-OFF]  4,96 0 top
U$4  [STAND-OFF]  96,96 0 top
U$5  [A4L-LOC]  -50.61,-49.42 0 top  (outside the outline)
U$7  [OSHW_5MM]  85.28,19.16 0 top
V1  77.03,93.2 180 top
V2  55.44,93.2 180 top
X1  4,61.07 270 top
X2  17.97,61.07 0 top
X3  4,39.48 270 top
X4  17.97,39.48 0 top
X5  4,17.89 270 top
X6  17.97,17.89 0 top

### Tracks (layer width: path | path; a pad name or v marks a point on that pad's centre or on a via)
+3V3
  Top 0.61: JP1.5 JP1.3 JP1.1 8.83,91.55 U11.3.3V 11.37,86.47 | U12.5 11.53,85.83 C7.1 | C7.1 11.37,86.47 | C7.1 11.37,86.47
+5V  (via drill 0.35)
  Top 0.254: R30.2 41.71,97.99 41.11,98.58 40.55,98.58 39.95,97.99 R33.2 39.56,97.9 35.75,94.09 32.81,94.09 29.41,90.7 29.41,90.29 29.4,90.28 29.4,86.47 v30.67,85.2
  Top 0.61: 16.76,82.66 U12.3 v18.03,82.66 18.35,82.98 C8.1
  Bottom 0.152: U8.6 18.24,13.93 C3.1 | U5.6 18.24,35.52 C2.1 | U2.6 18.24,57.11 C1.1 | U5.2 19.74,30.71 20.33,31.3 20.74,31.3 21.07,31.63 21.07,32.09 20.72,32.44 20.72,34.48
  Bottom 0.203: R6.2 27,55.14 26.25,54.39 22.4,54.39 20.47,56.32 19.33,56.32 C1.1 15.51,54.38 R1.2 6.16,54.38 5.97,54.19 5.97,54.15 5.27,53.45 0.74,53.45 | R12.2 27,33.55 26.25,32.8 22.4,32.8 20.72,34.48 20.47,34.73 19.33,34.73 C2.1 18.06,35.67 R7.2 6.16,32.79 5.97,32.6 5.97,32.56 5.27,31.86 0.74,31.86 | 18.24,13.93 19.03,13.14 20.47,13.14 22.4,11.21 26.25,11.21 27,11.96 R18.2 | C3.1 18.06,14.08 R13.2 15.18,9.82 9.27,3.92 6.54,3.92 6.06,4.4 6.06,4.86 4.86,6.06 4,6.06 3.79,6.27 2.29,6.27
  Bottom 0.254: 0.74,31.86 0.74,7.82 2.29,6.27 | R25.1 R27.1 31.09,85.62 v30.67,85.2
  Bottom 0.406: 0.74,53.45 0.74,31.86
  Bottom 0.508: 2.72,73.76 0.74,71.78 0.74,53.45
  Bottom 0.61: 16.74,89.04 18.03,87.74 v18.03,82.66 | 16.74,89.04 4.5,89.04 3.26,90.28 U11.VIN | 16.74,89.04 19.22,89.04 23.05,85.2 v30.67,85.2 U13.3
  Bottom 0.813: 2.72,73.76 42.09,73.76 U13.3
/MCU_RUN1  (via drill 0.35)
  Top 0.152: v21.27,57.77 21.27,64.88 21.27,73.52 U11.7
  Bottom 0.152: R5.2 23.9,55.14 v21.27,57.77
/MCU_RUN2  (via drill 0.35)
  Top 0.152: v39.31,45.53 X2.P$21 X2.P$22 39.3,67.24 38.2,68.33 28.87,68.33 27.88,69.33 U11.9
  Bottom 0.152: R11.2 27.35,35.31 27.35,35.84 29.06,37.55 29.59,37.55 32.08,40.04 38.97,40.04 39.31,40.37 v39.31,45.53
/MCU_RUN3  (via drill 0.35)
  Top 0.152: v41.47,18.65 41.84,19.03 X6.P$18 X4.P$17 X4.P$18 X2.P$17 X2.P$18 41.84,67.24 40.13,68.94 34.23,68.94 32.96,70.21 U11.11
  Bottom 0.152: v41.47,18.65 32.28,18.65 29.59,15.96 29.06,15.96 27.35,14.25 27.35,13.72 R17.2
/VALID1  (via drill 0.35)
  Top 0.152: U10.6 67.64,73.41 v67.5,73.26
  Top 0.254: LED1.C 41.51,92.75 41.51,92.54 40.52,91.55 33.21,91.55 32.96,91.3 U11.14/A0 33.96,89.28 35.91,89.28 36.5,89.86 36.5,89.89 37.02,90.41 47.31,90.41 60.26,77.45 v60.26,77.25
  Bottom 0.152: v67.5,73.26 64.03,73.26 62.65,71.88 62.19,71.88 61.86,72.2 61.86,72.8 60.26,74.41 v60.26,77.25
  Bottom 0.254: R25.2 33.97,89.1 33.97,89.26 U11.14/A0
/VALID2  (via drill 0.35)
  Top 0.152: U10.7 67.77,74.42 68.22,74.42 68.35,74.28 68.35,73.8 68.31,73.75 v68.31,73.39
  Top 0.254: LED2.C 38.73,93.34 38.57,93.5 32.93,93.5 32.53,93.1 32.53,92.82 30.42,90.71 U11.15/A1 31.83,88.87 36.08,88.87 37.21,90 47.14,90 59.45,77.69 v59.45,77.25
  Bottom 0.152: v68.31,73.39 68.06,73.14 68.06,73.03 67.73,72.71 67.27,72.71 67.02,72.96 64.16,72.96 62.78,71.57 62.06,71.57 61.56,72.08 61.56,72.5 59.96,74.1 59.96,76.56 59.45,77.07 v59.45,77.25
  Bottom 0.254: R27.2 31.81,88.72 31.81,88.88 U11.15/A1
CAN_RX
  Top 0.305: U12.4 16.92,85.03 R32.2
CAN_RX_T
  Top 0.305: U11.4 16.58,76.44 20.07,76.44 21.57,77.95 21.57,84.2 R32.1
CAN_TX
  Top 0.305: U12.1 16.92,79.02 R31.2
CAN_TX_T
  Top 0.305: U11.3 14.55,76.95 18.67,76.95 18.88,77.16 R31.1
CANH  (via drill 0.35)
  Top 0.61: U12.7 5.09,81.39 CON1.P$3 3.73,81.41 3.43,81.71 v3.43,82.66
  Bottom 0.61: CON2.P$3 3.73,83.91 3.43,83.61 v3.43,82.66
CANL  (via drill 0.35)
  Top 0.61: U12.6 v9.78,82.66 CON2.P$2
  Bottom 0.61: v9.78,82.66 CON2.P$2
CANSH  (via drill 0.35)
  Top 0.61: v2.57,82.66 2.59,82.68 2.59,83.01 2.79,83.21 2.79,83.61 3.09,83.91 CON1.P$1
  Bottom 0.61: CON2.P$1 3.09,81.41 2.79,81.71 2.79,82.11 2.59,82.31 2.59,82.64 v2.57,82.66
G1  (via drill 0.3)
  Top 0.152: Q6.4 82.27,80.12 82.74,80.12 82.99,79.87 82.99,76.82 82.87,76.69 78.55,76.69 78.3,76.94 78.3,77.58 | Q7.4 78.3,77.58 | v78.8,77.58 78.3,77.58
  Bottom 0.152: R36.2 C10.2 | R36.2 78.8,77.88 v78.8,77.58 | D7.C 79.03,78.1 R36.2
G1_DRIVER  (via drill 0.3)
  Top 0.152: U10.13 65.72,77.21 65.72,77.73 67.3,79.31 69.3,79.31 69.56,79.06 70.02,79.06 70.42,79.46 70.42,81.01 70.55,81.14 78.78,81.14 v78.93,80.99
  Bottom 0.152: v78.93,80.99 R36.1 80.35,79.7 D7.A
G2  (via drill 0.3)
  Top 0.152: Q4.4 75.88,80.12 76.39,80.12 76.64,79.87 76.64,76.94 76.52,76.82 71.95,76.82 Q5.4 71.69,77.96 v71.31,77.96
  Bottom 0.152: v71.31,77.96 71.31,77.92 C9.2 R35.2 74,78 D6.C
G2_DRIVER  (via drill 0.3)
  Top 0.152: U10.11 66.59,77.75 67.55,78.7 69.05,78.7 69.3,78.45 70.64,78.45 v70.92,78.72
  Bottom 0.152: v70.92,78.72 71.6,78.72 R35.1 74,79.7 D6.A
GATE_VOUT1  (via drill 0.35)
  Top 0.152: Q1.P$4 13.84,61.21 v13.53,61.21
  Bottom 0.152: U1.COLLECTOR 6.79,57.26 7.68,58.15 D1.2 11.44,59.33 R3.1 13.32,61.21 v13.53,61.21
GATE_VOUT2  (via drill 0.35)
  Top 0.152: Q2.P$4 13.82,39.62 v13.53,39.62
  Bottom 0.152: U4.COLLECTOR 6.79,35.67 7.68,36.56 D2.2 11.44,37.74 R9.1 13.32,39.62 v13.53,39.62
GATE_VOUT3  (via drill 0.35)
  Top 0.152: Q3.P$4 13.82,18.03 v13.53,18.03
  Bottom 0.152: U7.COLLECTOR 6.79,14.08 7.68,14.97 D3.2 11.44,16.15 R15.1 13.32,18.03 v13.53,18.03
GND  (via drill 0.35, 0.5)
  other vias: 14.7,85.68 14.7,86.31 15.49,81.07 15.49,81.71 53.53,75.04 56.07,72.5 56.07,75.04 58.61,75.04 64.96,69.07 68.77,72.5 65.59,74.28 66.36,75.04 65.59,75.8 64.83,75.04 33.21,97.9 35.75,97.9 38.29,97.9 40.83,97.9 43.37,97.9 45.91,97.9 48.45,97.9 50.99,97.9 50.99,95.36 48.45,95.36 45.91,95.36 43.37,95.36 40.83,95.36 38.29,95.36 35.75,95.36 33.21,95.36 50.99,92.82 48.45,92.82 45.91,92.82 43.37,92.82 40.83,92.82 38.29,92.82 35.75,92.82 33.21,92.82 50.99,90.28 48.45,90.28 53.53,92.82 53.53,95.36 53.53,86.47 56.07,86.47 56.07,83.93 58.61,81.39 61.15,78.85 38.29,87.74 43.37,87.74 45.91,89.01 43.37,85.2 38.29,85.2 38.29,82.66 43.37,82.66 45.91,82.66 48.45,82.66 38.29,80.12 45.91,77.58 48.45,77.58 48.45,75.04 45.91,75.04 45.91,72.5 43.37,72.5 48.45,72.5 48.45,69.96 50.99,69.96 53.53,69.96 56.07,69.96 58.61,67.42 56.07,67.42 53.53,67.42 50.99,67.42 48.45,67.42 45.91,67.42 45.91,69.96 43.37,69.96 40.83,69.96 38.29,69.96 38.29,72.5 40.83,72.5 35.75,82.66 30.67,82.66 30.67,80.12 33.21,80.12 28.13,82.66 28.13,80.12 25.59,80.12 25.59,82.66 23.05,82.66 23.05,80.12 23.05,77.58 25.59,77.58 28.13,77.58 30.67,77.58 33.21,77.58 35.75,77.58 38.29,75.04 28.13,87.74 30.67,87.74 25.59,87.74 9.08,86.47 6.54,86.47 4,87.74 1.46,92.82 4,92.82 6.54,92.82 11.62,92.82 14.16,92.82 16.7,92.82 19.24,92.82 4,72.5 6.54,72.5 9.08,72.5 11.62,72.5 14.16,72.5 16.7,72.5 19.24,72.5 19.24,69.96 16.7,69.96 14.16,69.96 11.62,69.96 9.08,69.96 6.54,69.96 6.54,67.42 9.08,67.42 11.62,67.42 14.16,67.42 16.7,67.42 19.24,67.42 19.24,64.88 16.7,64.88 14.16,64.88 11.62,64.88 9.08,64.88 6.54,64.88 6.54,62.34 9.08,62.34 11.62,62.34 14.16,62.34 26.86,72.5 26.86,69.96 29.4,69.96 29.4,72.5 31.94,72.5 31.94,69.96 34.48,69.96 34.48,72.5 20.51,62.34 20.51,59.8 2.09,68.69 2.09,66.15 2.09,63.61 2.09,61.07 6.54,48.37 9.08,48.37 11.62,48.37 14.16,48.37 16.7,48.37 16.7,45.83 14.16,45.83 11.62,45.83 9.08,45.83 6.54,45.83 6.54,43.29 9.08,43.29 11.62,43.29 14.16,43.29 16.7,43.29 19.24,43.29 19.24,45.83 21.78,45.83 24.32,45.83 26.86,45.83 29.4,45.83 31.94,45.83 6.54,40.75 9.08,40.75 11.62,40.75 14.16,40.75 6.54,26.78 9.08,26.78 11.62,26.78 14.16,26.78 14.16,24.24 11.62,24.24 9.08,24.24 6.54,24.24 6.54,21.7 9.08,21.7 11.62,21.7 14.16,21.7 6.54,19.16 9.08,19.16 11.62,19.16 14.16,19.16 16.7,26.78 16.7,24.24 16.7,21.7 19.24,21.7 19.24,24.24 21.78,24.24 24.32,24.24 26.86,24.24 29.4,24.24 31.94,24.24 49.72,33.13 52.26,33.13 54.8,33.13 57.34,33.13 57.34,30.59 54.8,30.59 52.26,30.59 49.72,30.59 49.72,28.05 52.26,28.05 54.8,28.05 57.34,28.05 49.72,25.51 52.26,25.51 54.8,25.51 57.34,25.51 44.64,33.13 47.18,33.13 47.18,30.59 44.64,30.59 44.64,28.05 47.18,28.05 44.64,25.51 47.18,25.51 59.88,33.13 59.88,30.59 59.88,28.05 59.88,25.51 49.72,54.72 52.26,54.72 54.8,54.72 57.34,54.72 57.34,52.18 54.8,52.18 52.26,52.18 49.72,52.18 49.72,49.64 52.26,49.64 54.8,49.64 57.34,49.64 49.72,47.1 52.26,47.1 54.8,47.1 57.34,47.1 44.64,54.72 47.18,54.72 47.18,52.18 44.64,52.18 44.64,49.64 47.18,49.64 44.64,47.1 47.18,47.1 59.88,54.72 59.88,52.18 59.88,49.64 59.88,47.1 49.72,11.54 52.26,11.54 54.8,11.54 57.34,11.54 57.34,9 54.8,9 52.26,9 49.72,9 49.72,6.46 52.26,6.46 54.8,6.46 57.34,6.46 49.72,3.92 52.26,3.92 54.8,3.92 57.34,3.92 44.64,11.54 47.18,11.54 47.18,9 44.64,9 44.64,6.46 47.18,6.46 44.64,3.92 47.18,3.92 59.88,11.54 59.88,9 59.88,6.46 59.88,3.92 42.1,11.54 39.56,11.54 37.02,11.54 37.02,9 39.56,9 42.1,9 42.1,6.46 42.1,3.92 42.1,1.38 44.64,1.38 47.18,1.38 49.72,1.38 52.26,1.38 54.8,1.38 57.34,1.38 59.88,1.38 62.42,1.38 64.96,1.38 67.5,1.38 70.04,1.38 72.58,1.38 75.12,1.38 77.66,1.38 80.2,1.38 85.28,1.38 82.74,1.38 87.82,1.38 90.36,1.38 92.9,1.38 39.56,1.38 37.02,1.38 34.48,1.38 31.94,1.38 29.4,1.38 26.86,1.38 24.32,1.38 21.78,1.38 19.24,1.38 16.7,1.38 14.16,1.38 11.62,1.38 9.08,1.38 6.54,1.38 11.62,3.92 97.98,9 97.98,11.54 97.98,14.08 97.98,16.62 97.98,19.16 97.98,21.7 97.98,24.24 97.98,26.78 97.98,29.32 97.98,31.86 97.98,34.4 97.98,36.94 97.98,39.48 97.98,42.02 97.98,47.1 97.98,44.56 97.98,49.64 97.98,52.18 97.98,54.72 97.98,57.26 97.98,59.8 97.98,67.42 97.98,69.96 97.98,72.5 97.98,75.04 97.98,77.58 97.98,80.12 97.98,82.66 97.98,85.2 97.98,87.74 97.98,90.28 95.44,90.28 95.44,87.74 95.44,85.2 95.44,82.66 95.44,80.12 95.44,77.58 92.9,77.58 92.9,80.12 92.9,82.66 92.9,85.2 92.9,87.74 92.9,90.28 92.9,92.82 90.36,77.58 87.82,77.58 85.28,77.58 59.88,22.97 59.88,20.43 59.88,17.89 59.88,15.35 57.34,17.89 54.8,17.89 52.26,17.89 49.72,17.89 49.72,20.43 49.72,14.08 59.88,39.48 59.88,36.94 59.88,42.02 57.34,39.48 54.8,39.48 52.26,39.48 49.72,39.48 49.72,42.02 49.72,36.94 59.88,61.07 57.34,61.07 59.88,63.61 59.88,58.53 54.8,61.07 52.26,61.07 49.72,61.07 49.72,63.61 49.72,58.53 75.12,95.36 75.12,92.82 72.58,92.82 72.58,95.36 72.58,90.28 72.58,97.9 7.81,6.46 37.02,54.72 38.29,33.13 39.94,54.85 41.21,54.85 42.48,54.85 42.48,61.2 41.21,61.2 39.94,61.2 34.86,52.31 39.94,39.61 42.48,39.61 42.48,31.99 34.86,30.72 37.4,67.55 69.15,74.66 19.24,15.35 19.24,36.94 22.42,72.5 22.42,69.96 32.96,64.88 4,76.82 4.38,79.61 15.3,78.22 70.67,68.69 97.98,64.88 97.98,62.34 59.37,73.26
  pour Top (rank 6, no thermals): 0,100 0,0 100,0 100,100
  pour Bottom (rank 6, no thermals): 0,100 0,0 100,0 100,100
HYS
  Top 0.152: R26.1 61.28,74.04 U10.20
I2C_3V3
  Bottom 0.508: 22.8,95.99 14.22,95.99 13.91,96.31 JP1.6 | 22.8,96.95 21.84,95.99 22.8,95.04
  Bottom 0.813: JP2.7 22.8,96.95 22.8,95.99 22.8,95.04 JP2.8
INTVCC  (via drill 0.35)
  Top 0.152: U10.10 68.48,76.04 C5.1 69.15,76.61 v69.53,76.24 | U10.18 U10.19 62.71,74.54 62.65,74.48 62.19,74.48 62.13,74.54 59.25,74.54 58.75,74.03 R37.1 58.75,71.81 58.86,71.69 58.97,71.59 62.27,68.28 69.28,68.28 70.34,69.35 70.34,74.91 70.39,74.95 70.39,75.26 70.55,75.42 v70.64,75.42
  Bottom 0.152: v70.64,75.42 69.82,76.24 v69.53,76.24
KILL_SWITCH_C  (via drill 0.35)
  Top 0.152: Q8.3 3.37,78.22 0.41,75.26 0.41,51.13 1.26,50.27 v2.03,50.27
  Top 0.203: JP3.1 14.16,3.92 11.69,6.39 v11.69,7.16 | v2.03,50.27 v2.03,29.45 v2.03,13.51
  Bottom 0.203: v11.69,7.16 13.4,8.87 U7.CATHODE 8.83,10.52 8.19,11.16 3.11,11.16 2.03,12.24 v2.03,13.51 | v2.03,50.27 2.67,50.91 7.23,50.91 7.59,51.27 7.59,52.4 8.89,53.7 U1.CATHODE | U4.CATHODE 8.9,32.11 7.59,30.8 7.59,29.68 7.35,29.45 v2.03,29.45
N$1
  Top 0.203: R38.2 33.21,81.39 40.22,88.4 43.64,88.4 44.03,88.01 44.03,87.63 D8.A
  Top 1.27: F6.1 50.99,82.66 47.56,86.09 D8.A
N$2
  Bottom 0.152: R2.2 6.79,51.93 U1.EMITTER
N$3
  Bottom 0.152: U3.ANODE 23.56,57.26 23.98,56.84 R5.1
N$4
  Bottom 0.152: R1.1 13.4,56.08 U1.ANODE
N$5
  Top 0.254: R30.1 LED1.A
N$6
  Top 0.254: R33.1 LED2.A
N$7
  Bottom 0.152: R8.2 6.79,30.34 U4.EMITTER
N$8
  Bottom 0.152: R7.1 13.4,34.49 U4.ANODE
N$9
  Bottom 0.152: U6.ANODE 23.56,35.67 23.98,35.25 R11.1
N$10
  Top 0.152: U11.2 10.1,75.95 Q8.1
N$11
  Top 1.27: D8.C 41.17,79.78 U13.1
N$13
  Bottom 0.152: R14.2 6.79,8.75 U7.EMITTER
N$14
  Bottom 0.152: R13.1 13.4,12.9 U7.ANODE
N$15
  Bottom 0.152: U9.ANODE 23.56,14.08 23.98,13.66 R17.1
OV1
  Top 0.152: R20.1 64.19,70.59 64.46,70.59 R21.2 64.96,71.48 65.59,72.12 U10.3
OV2
  Top 0.152: R23.1 68,70.59 68.27,70.59 R24.2 66.88,72.99 U10.5
PGOOD1  (via drill 0.35)
  Top 0.152: X2.P$25 v36.76,60.56 X2.P$26 36.7,64.5 36.7,67.04 35.71,68.03 25.61,68.03 25.34,68.31 U11.8
  Bottom 0.152: R6.1 30,56.84 33.72,60.56 v36.76,60.56
PGOOD2  (via drill 0.35)
  Top 0.152: U11.10 30.42,69.39 31.17,68.64 39.23,68.64 40.57,67.3 X2.P$20 X2.P$19 40.57,45.46 40.07,44.96 37.42,44.96 37.29,44.83 37.29,43.39 X4.P$26 v36.76,38.97 X4.P$25
  Bottom 0.152: R12.1 30,35.25 33.72,38.97 v36.76,38.97
PGOOD3  (via drill 0.35)
  Top 0.152: X6.P$25 v36.76,17.38 X6.P$26 36.76,23.98 37.02,24.24 v41.28,24.24 | v42.4,24.24 43.11,24.95 X4.P$15 X4.P$16 X2.P$15 X2.P$16 43.11,67.24 41.1,69.25 36.58,69.25 35.5,70.33 U11.12
  Bottom 0.152: R18.1 30,13.66 33.72,17.38 v36.76,17.38 | v41.28,24.24 v42.4,24.24
RUN1  (via drill 0.35)
  Top 0.152: X2.P$23 v38.03,61.07 X2.P$24
  Bottom 0.152: U3.COLLECTOR 32.7,61.07 36.48,61.07 36.53,61.12 36.99,61.12 37.04,61.07 v38.03,61.07
RUN2  (via drill 0.35)
  Top 0.152: X4.P$24 v38.03,39.48 X4.P$23
  Bottom 0.152: U6.COLLECTOR 32.7,39.48 36.48,39.48 36.53,39.53 36.99,39.53 37.04,39.48 v38.03,39.48
RUN3  (via drill 0.35)
  Top 0.152: X6.P$23 v38.03,17.89 X6.P$24
  Bottom 0.152: U9.COLLECTOR 32.7,17.89 36.48,17.89 36.53,17.94 36.99,17.94 37.04,17.89 v38.03,17.89
SCL  (via drill 0.35)
  Top 0.152: 23.05,93.61 22.33,93.61 21.81,94.12 21.37,94.57 20.89,95.05 R28.2 | 23.05,93.61 24.22,93.61 JP2.6 | v19.24,5.65 31.7,5.65 35.5,9.44 X6.P$27 X6.P$28 v35.49,33.38 X4.P$27 X4.P$28 v35.49,54.97 X2.P$27 X2.P$28 35.49,66.98 34.75,67.72 24.45,67.72 24.16,68.02 24.16,86.64 v24.37,86.85 | v33.66,33.4 32.99,32.73 32.99,28.6 31.63,27.24 v19.24,27.24 | v33.66,54.99 32.99,54.32 32.99,50.19 31.63,48.83 v19.24,48.83 | U11.19/A5 23.05,93.07 23.05,93.61
  Bottom 0.152: JP2.6 JP2.5 | v19.24,5.65 19.01,5.88 19,5.88 18.24,6.64 U8.5 | v19.24,27.24 19.01,27.47 19,27.47 18.24,28.23 U5.5 | v33.66,33.4 35.47,33.4 v35.49,33.38 | v19.24,48.83 19.01,49.06 19,49.06 18.24,49.82 U2.5 | v33.66,54.99 35.47,54.99 v35.49,54.97 | v24.37,86.85 20.94,90.28 U11.19/A5
SCL_3V3
  Top 0.508: JP1.2 9.71,97.27 11.54,99.09 17.68,99.09 19.36,97.42 R28.1
SDA  (via drill 0.35)
  Top 0.152: X2.P$29 X4.P$30 X4.P$29 34.22,35.99 34.22,34.77 | 34.22,34.77 X6.P$30 X6.P$29 34.22,8.74 31.94,6.46 v19.24,6.46 | R29.2 17.41,94.57 18.83,95.99 26.61,95.99 JP2.4 27.24,94.73 22.89,90.37 U11.18/A4 23.81,89.26 23.81,67.93 24.32,67.42 33.78,67.42 34.22,66.98 X2.P$30 X2.P$29 | v19.24,28.05 31.94,28.05 32.64,28.75 32.64,33.19 34.22,34.77 | v19.24,49.64 31.94,49.64 32.64,50.34 32.64,54.78 34.22,56.36 X2.P$29
  Bottom 0.152: JP2.4 JP2.3 | U8.4 18.74,7.22 | 18.74,7.22 18.74,6.96 v19.24,6.46 | U5.4 18.74,28.55 v19.24,28.05 | U2.4 18.74,50.14 v19.24,49.64 | U8.2 19.75,7.48 19.49,7.22 18.74,7.22
SDA_3V3
  Top 0.508: JP1.4 12.53,98.43 14.39,98.43 15.18,97.65 15.41,97.42 15.88,96.95 R29.1
STB
  Top 0.305: R34.2 11.53,78.22 U12.8
TMR
  Top 0.152: U10.1 61.53,72.99 61.02,72.48 C4.2 61.01,72.37 R37.2
UV1
  Top 0.152: R19.1 R20.2 64.46,71.86 64.83,71.86 65.09,72.13 U10.2
UV2
  Top 0.152: R23.2 R22.1 66.09,71.23 U10.4
V1  (via drill 0.35)
  Top 0.152: R19.2 62.42,70.12 61.84,70.7 61.84,71.49 62.42,72.07 v62.42,72.43 | v62.42,75.04 62.55,75.04 63.05,75.54 U10.17 63.1,75.54 62.84,75.8 62.84,78.43 62.04,79.23 62.04,86.72 62.29,86.98 76.64,86.98 77.03,86.6 77.03,86.22 77.41,85.83 77.89,85.83 Q6.5
  Bottom 0.152: v62.42,72.43 v62.42,75.04
  Bottom 1.27: F5.P$2 84.47,83.93 D5.C
  pour Top (no thermals): 77.66,86.47 91.63,86.47 91.63,80.12 84.01,80.12 84.01,81.39 77.66,81.39
V1_ANALOG_IN
  Top 0.203: R38.1 R39.2 27.71,86.89 25.34,89.26 U11.17/A3
V2  (via drill 0.35)
  Top 0.152: F4.P$2 63.55,81.3 U10.16 | R22.2 66.53,70.09 67.06,69.57 69.22,69.57 70.04,70.39 70.04,75.04 70.08,75.08 v70.08,77.15 | F4.P$1 68.77,81.44 v68.77,80.17
  Bottom 0.152: v70.08,77.15 70.08,78.86 69.88,79.06 69.56,79.06 69.23,79.38 69.23,79.71 v68.77,80.17
  Bottom 1.27: F4.P$2 62.88,83.93 D4.C
  pour Top (no thermals): 76.39,86.47 62.42,86.47 62.42,80.12 70.04,80.12 70.04,81.39 76.39,81.39
VBAT1
  pour Top (no thermals): 77.66,99.17 91.63,99.17 91.63,87.74 77.66,87.74
VBAT2
  pour Top (no thermals): 56.07,99.17 70.04,99.17 70.04,87.74 56.07,87.74
VIN  (via drill 0.3, 0.35)
  Top 0.152: U10.15 64.59,77.94 v64.45,78.09 | v62.28,76.69 51.73,76.69 F6.2
  Top 1.27: F6.2 50.99,73.77 53.53,71.23 58.1,71.23 61.91,67.42 78.93,67.42
  Bottom 0.152: v64.45,78.09 63.06,76.69 v62.28,76.69 | C10.1 78.08,75.8 v77.79,75.8 | C9.1 71.54,75.99 v71.54,76.04
  pour Top (rank 2, no thermals): 71.31,76.31 71.31,67.42 77.66,67.42 77.66,3.92 95.44,3.92 95.44,76.31
VIN1
  pour Top (no thermals): 61.15,66.15 61.15,47.1 77.66,47.1 77.66,66.15
VIN2
  pour Top (no thermals): 61.15,44.56 61.15,25.51 77.66,25.51 77.66,44.56
VIN3
  pour Top (no thermals): 61.15,22.97 61.15,3.92 77.66,3.92 77.66,22.97
VOUT1  (via drill 0.35)
  Top 0.152: R4.1 | v19.49,53.45 R4.1 | v18.99,54.34 16.83,54.34 | Q1.P$3 15.72,59.19 v15.75,59.16
  Bottom 0.152: v19.49,53.45 19.74,53.7 U2.9 | U2.8 19.24,54.59 v18.99,54.34 | R3.2 14.73,60.18 v15.75,59.16 15.75,58.59 15.3,58.15 D1.1 14.84,58.26
  pour Top (no thermals): 17.33,50.91 17.33,59.8 13.65,59.8 13.65,55.74 7.43,55.74 7.43,56.88 2.73,56.88 2.73,50.91
VOUT2  (via drill 0.35)
  Top 0.152: R10.1 | v19.49,31.86 R10.1 | v18.99,32.75 16.83,32.75 | Q2.P$3 v15.75,37.58
  Bottom 0.152: v19.49,31.86 19.74,32.11 U5.9 | U5.8 19.24,33 v18.99,32.75 | 14.84,36.67 D2.1 15.3,36.56 15.75,37 v15.75,37.58 14.73,38.59 R9.2
  pour Top (no thermals): 17.33,29.32 17.33,38.21 13.65,38.21 13.65,34.15 7.43,34.15 7.43,35.29 2.73,35.29 2.73,29.32
VOUT3  (via drill 0.3, 0.35)
  Top 0.152: R16.1 | v19.49,10.27 R16.1 | v18.99,11.16 16.83,11.16 | Q3.P$3 15.72,16.01 v15.75,15.98
  Bottom 0.152: v19.49,10.27 19.74,10.52 U8.9 | U8.8 19.24,11.41 v18.99,11.16 | 14.84,15.08 D3.1 15.3,14.97 15.75,15.41 v15.75,15.98 14.73,17 R15.2
  pour Top (no thermals): 17.33,7.73 17.33,16.62 13.65,16.62 13.65,12.56 7.43,12.56 7.43,13.7 2.73,13.7 2.73,7.73
VOUT_SENSE1  (via drill 0.35)
  Top 0.152: R4.2 v20.51,53.45
  Bottom 0.152: v20.51,53.45 20.24,53.72 U2.10
  pour Top (no thermals): 31.94,66.15 21.78,66.15 21.78,55.99 21.14,55.99 21.14,50.91 31.94,50.91
VOUT_SENSE2  (via drill 0.35)
  Top 0.152: R10.2 v20.51,31.86
  Bottom 0.152: v20.51,31.86 20.24,32.13 U5.10
  pour Top (no thermals): 31.94,44.56 21.14,44.56 21.14,29.32 31.94,29.32
VOUT_SENSE3  (via drill 0.35)
  Top 0.152: R16.2 v20.51,10.27
  Bottom 0.152: v20.51,10.27 20.24,10.54 U8.10
  pour Top (no thermals): 31.94,22.97 21.14,22.97 21.14,7.73 31.94,7.73
VOUT_SWITCHED1
  pour Top (no thermals): 2.73,57.26 7.81,57.26 7.81,56.24 13.27,56.24 13.27,60.82 2.73,60.82
VOUT_SWITCHED2
  pour Top (no thermals): 2.73,35.67 7.81,35.67 7.81,34.65 13.27,34.65 13.27,39.23 2.73,39.23
VOUT_SWITCHED3
  pour Top (no thermals): 2.73,14.08 7.81,14.08 7.81,13.06 13.27,13.06 13.27,17.64 2.73,17.64
VS1  (via drill 0.35)
  Top 0.152: U10.14 65.22,77.21 65.22,77.66 67.17,79.61 v69.79,79.61 | 78.3,80.02 77.66,79.36 77.66,77.53 76.64,76.51 71.82,76.51 71.18,77.15 v70.89,77.15
  Bottom 0.152: v70.89,77.15 70.39,77.65 70.39,78.98 69.79,79.58 v69.79,79.61
  pour Top (no thermals): 77.66,78.85 77.66,76.82 82.74,76.82 82.74,80.88 77.66,80.88
VS2
  Top 0.152: U10.12 66.09,77.68 67.42,79 69.18,79 69.43,78.75 70.14,78.75 70.88,79.48 71.56,79.48
  pour Top (no thermals): 71.31,78.85 71.31,76.82 76.39,76.82 76.39,78.85 76.39,80.88 71.31,80.88

### Text on the board
tPlace: V2 | V1 | GND | REV. 1.4 | CARD EDGE / DC-DC CONVERTER / CARRIER BOARD | VOUT1 | GND | INPUT: 12.5-30V | ALAIN L. / 2019-10 | VOUT2 | GND | OUTPUT: 3.3-24V | VOUT3
tNames: I2C | 3V3 | SCL | SDA | GND | S | L | CAN | H
bNames: H | L | CAN | S
Document: NOTES: / 1. Solder board in following order: / 1.1 Reflow solder top surface mounted components / except edge connectors / 1.2 Hand solder bottom components / 1.3 Hand solder remaining top components / 1.3.1 Solder edge connectors first / 2. Use LP MINI 891 fuses for F1 through F5 / 3. 2oz copper suggested, but not required